# Altium project Apalis Evaluation Board.PrjPCB (part 3 of 5)

## Sheet Power_Switch.SchDoc: Apalis Evaluation Board 1.1
size A3; Organization: Toradex AG; Address1: Altsagenstrasse 5; Address2: Horw; Address3: 6048; Address4: Switzerland; DocumentNumber: 4; Revision: V1.1; SheetNumber: 4; SheetTotal: 32; PageSetup: Record=PageOptions|CenterHorizontal=True|CenterVertical=True|PrintScale=0.73|XCorrection=1.00|YCorrection=1.00|PrintKind=0|BorderSize=5000000|LeftOffset=0|BottomOffset=0|Orientation=2|PaperLength=1000|PaperWidth=1000|Scale=100|PaperSource=7|PrintQuality=-4|MediaType=1|DitherType=10|PaperKind=A4|PrintScaleMode=1
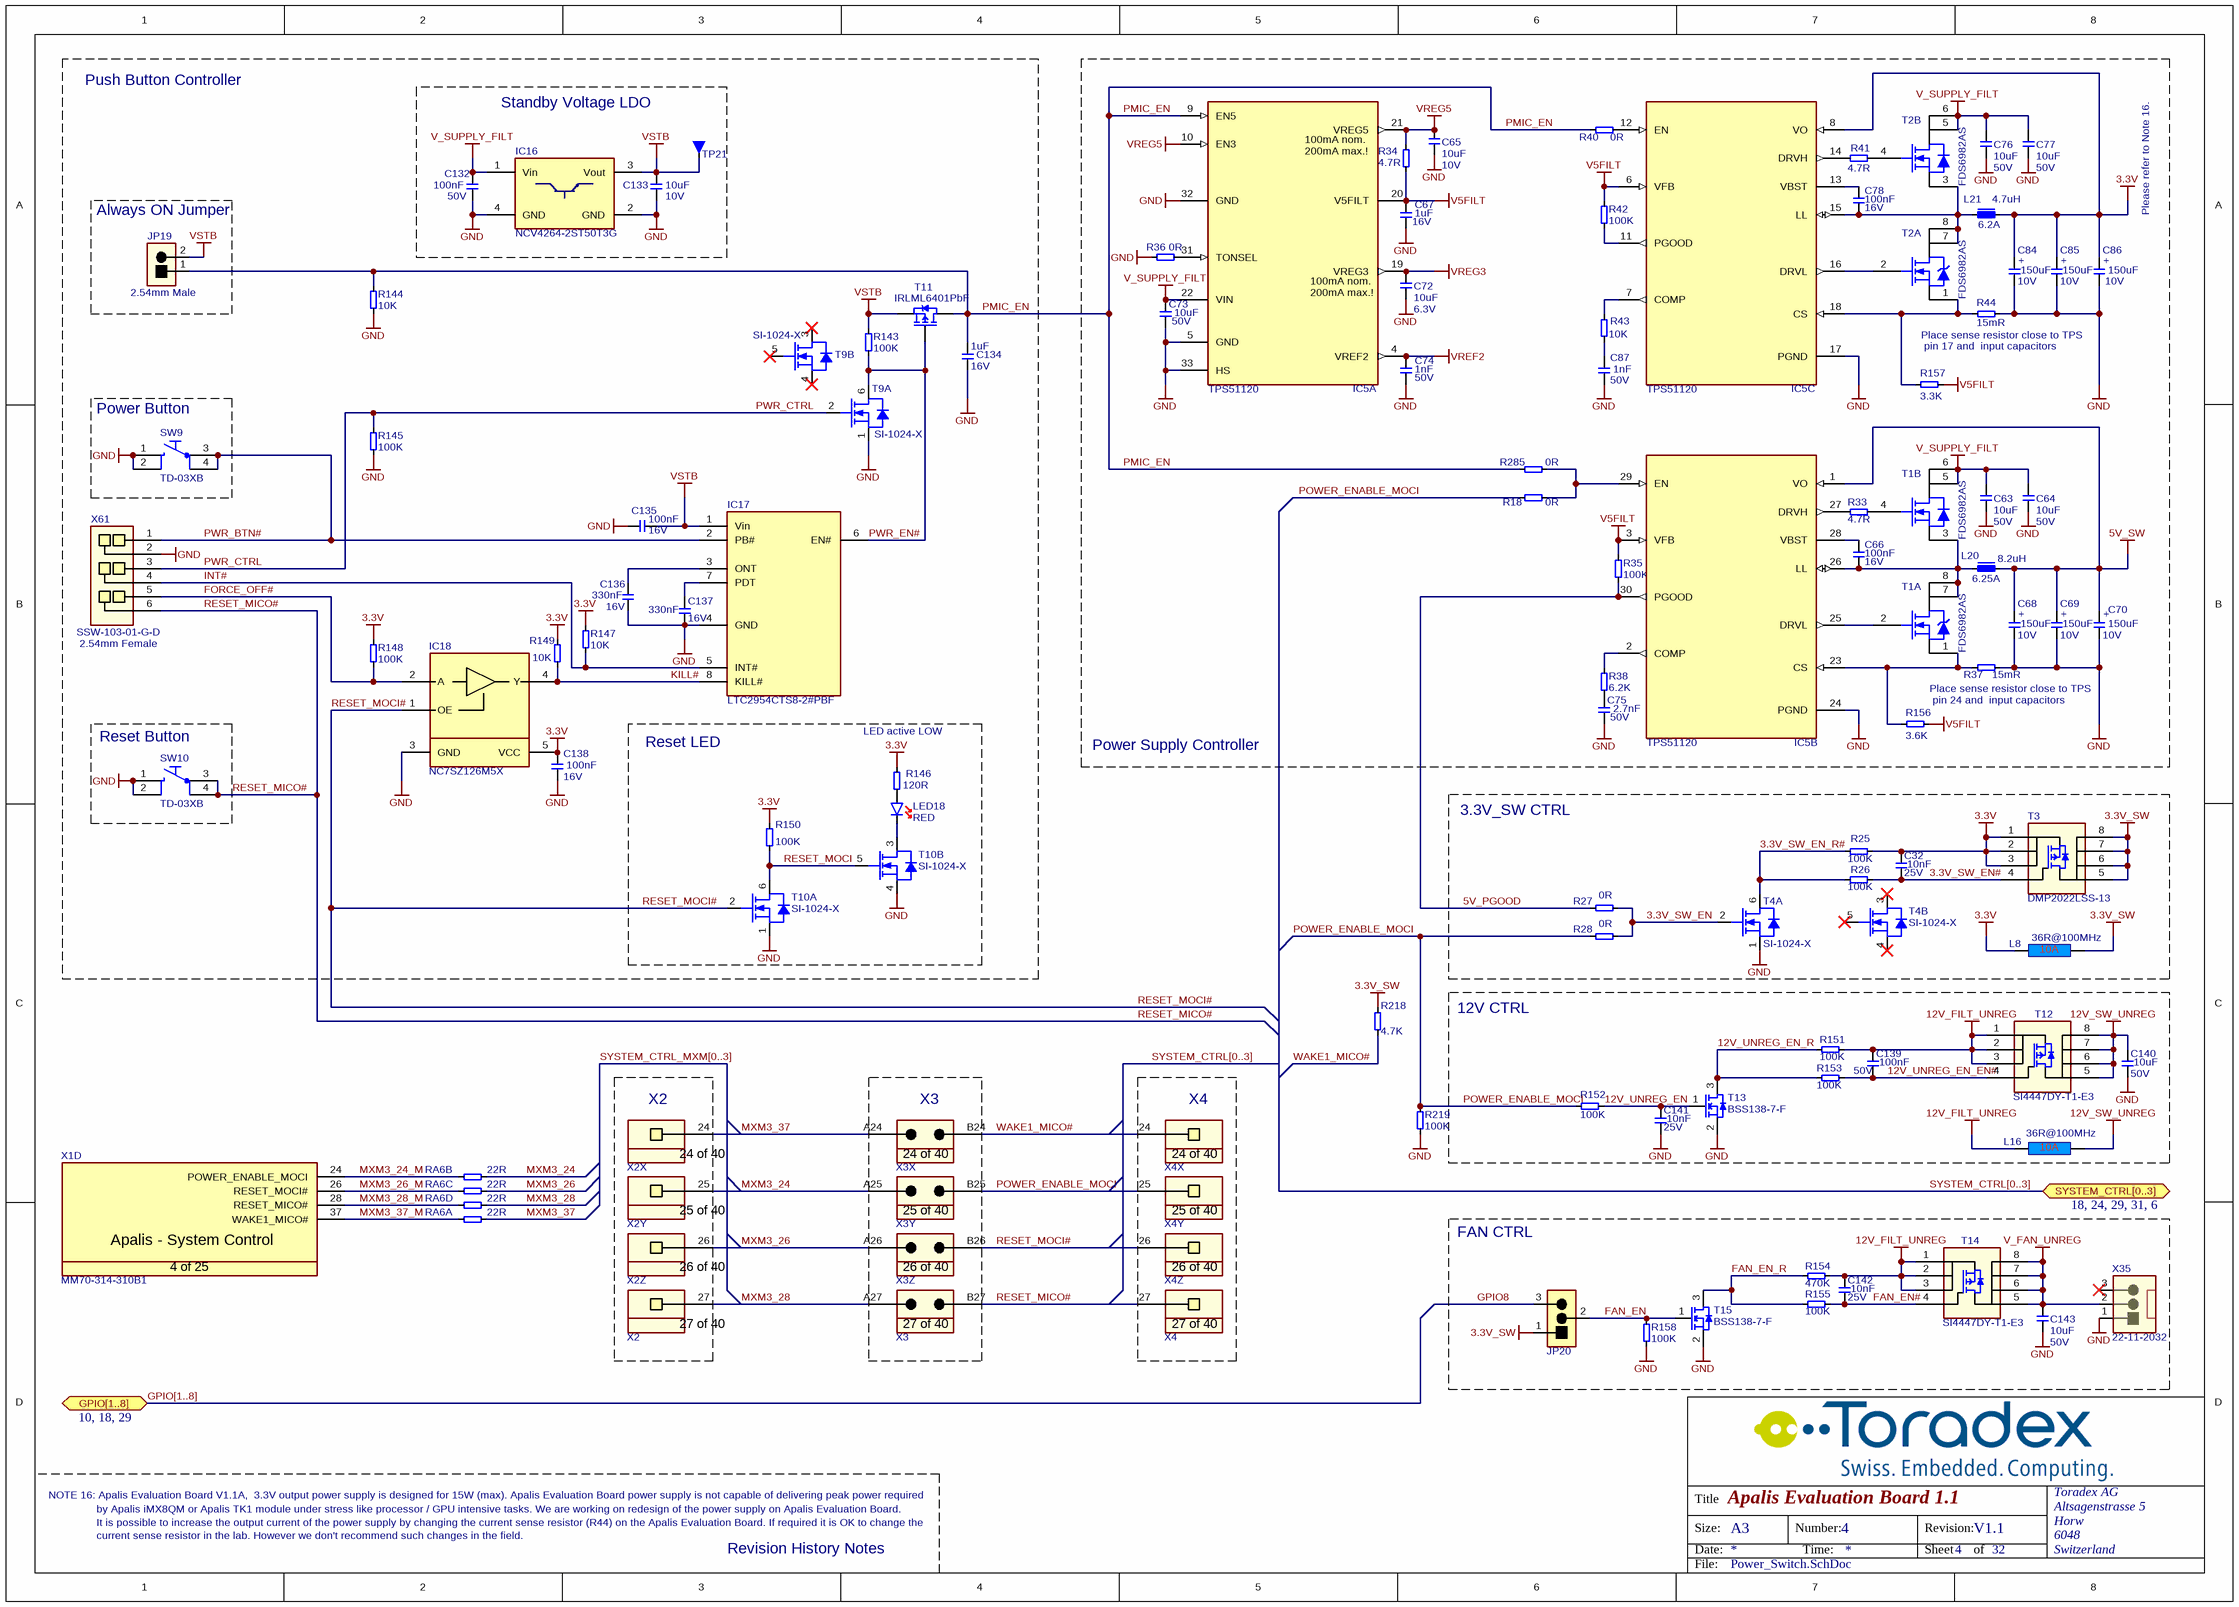
[diagram p14: Power_Switch.SchDoc]

### Parts
C32  Rating: 25V  [T_CAPC0603X33N]  (hidden comment: 10nF)
C63  Rating: 50V  [CAPC3225X160N]  (hidden comment: 10uF)
C64  Rating: 50V  [CAPC3225X160N]  (hidden comment: 10uF)
C65  Rating: 10V  [T_CAPC0805X125N]  (hidden comment: 10uF)
C66  Rating: 16V  [T_CAPC0603X33N]  (hidden comment: 100nF)
C67  Rating: 16V  [T_CAPC0603X33N]  (hidden comment: 1uF)
C68  Rating: 10V  [CAPMP7343X310N]  (hidden comment: 150uF)
C69  Rating: 10V  [CAPMP7343X310N]  (hidden comment: 150uF)
C70  Rating: 10V  [CAPMP7343X310N]  (hidden comment: 150uF)
C72  Rating: 6.3V  [T_CAPC0603X33N]  (hidden comment: 10uF)
C73  Rating: 50V  [CAPC3225X160N]  (hidden comment: 10uF)
C74  Rating: 50V  [T_CAPC0603X33N]  (hidden comment: 1nF)
C75  Rating: 50V  [CAPC1005X60N]  (hidden comment: 2.7nF)
C76  Rating: 50V  [CAPC3225X160N]  (hidden comment: 10uF)
C77  Rating: 50V  [CAPC3225X160N]  (hidden comment: 10uF)
C78  Rating: 16V  [T_CAPC0603X33N]  (hidden comment: 100nF)
C84  Rating: 10V  [CAPMP7343X310N]  (hidden comment: 150uF)
C85  Rating: 10V  [CAPMP7343X310N]  (hidden comment: 150uF)
C86  Rating: 10V  [CAPMP7343X310N]  (hidden comment: 150uF)
C87  Rating: 50V  [T_CAPC0603X33N]  (hidden comment: 1nF)
C132  Rating: 50V  [T_CAPC0603X33N]  (hidden comment: 100nF)
C133  Rating: 10V  [T_CAPC0805X125N]  (hidden comment: 10uF)
C134  Rating: 16V  [T_CAPC0603X33N]  (hidden comment: 1uF)
C135  Rating: 16V  [T_CAPC0603X33N]  (hidden comment: 100nF)
C136  Rating: 16V  [T_CAPC0805X125N]  (hidden comment: 330nF)
C137  Rating: 16V  [T_CAPC0805X125N]  (hidden comment: 330nF)
C138  Rating: 16V  [T_CAPC0603X33N]  (hidden comment: 100nF)
C139  Rating: 50V  [T_CAPC0603X33N]  (hidden comment: 100nF)
C140  Rating: 50V  [CAPC3225X160N]  (hidden comment: 10uF)
C141  Rating: 25V  [T_CAPC0603X33N]  (hidden comment: 10nF)
C142  Rating: 25V  [T_CAPC0603X33N]  (hidden comment: 10nF)
C143  Rating: 50V  [CAPC3225X160N]  (hidden comment: 10uF)
IC5  TPS51120  [QFN50P500X500X100-33N]  (parts A,B,C of 3)
IC16  NCV4264-2ST50T3G  [T_ON_NCV4264-2ST50T3G]
IC17  LTC2954CTS8-2#PBF  [T_LINEAR_LTC2954CTS8-2#PBF]
IC18  NC7SZ126M5X  [SOT95P279X142-5N]
JP19  TSW-101-07-G-D  [T_Samtec_TSW-101-07-G-D]  (value not drawn)
JP20  826936-3  [T_TYCO_826936-3]  (value not drawn)
L8  36R@100MHz  [T_Laird_35F0121-0SR-10]
L16  36R@100MHz  [T_Laird_35F0121-0SR-10]
L20  Rating: 6.25A  [T_INDM120120X80N]  (hidden comment: 8.2uH)
L21  Rating: 6.2A  [T_INDM102102X45N]  (hidden comment: 4.7uH)
LED18  Color: RED  [T_Osram_T670_RED]  (hidden comment: LS T670-K1L2-1)
R18  0R  [T_RESC0603X30N]
R25  100K  [T_RESC0603X30N]
R26  100K  [T_RESC0603X30N]
R27  0R  [T_RESC0603X30N]
R28  0R  [T_RESC0603X30N]
R33  4.7R  [RESC1005X40N]
R34  4.7R  [RESC1005X40N]
R35  100K  [T_RESC0603X30N]
R36  0R  [T_RESC0603X30N]
R37  15mR  [RESC3316X76N]
R38  6.2K  [RESC1005X40N]
R40  0R  [T_RESC0603X30N]
R41  4.7R  [RESC1005X40N]
R42  100K  [T_RESC0603X30N]
R43  10K  [RESC1005X40N]
R44  15mR  [RESC3316X76N]
R143  100K  [T_RESC0603X30N]
R144  10K  [T_RESC0603X30N]
R145  100K  [T_RESC0603X30N]
R146  120R  [T_RESC0603X30N]
R147  10K  [T_RESC0603X30N]
R148  100K  [T_RESC0603X30N]
R149  10K  [T_RESC0603X30N]
R150  100K  [T_RESC0603X30N]
R151  100K  [T_RESC0603X30N]
R152  100K  [T_RESC0603X30N]
R153  100K  [T_RESC0603X30N]
R154  470K  [T_RESC0603X30N]
R155  100K  [T_RESC0603X30N]
R156  3.6K  [T_RESC0603X30N]
R157  3.3K  [T_RESC0603X30N]
R158  100K  [T_RESC0603X30N]
R218  4.7K  [t_RESC0603X30N]
R219  100K  [T_RESC0603X30N]
R285  0R  [T_RESC0603X30N]
RA6  22R  [T_Resistor_Array_X4]  (parts A,B,C,D of 4)
SW9  TD-03XB  [T_WMF_TD-03XB]
SW10  TD-03XB  [T_WMF_TD-03XB]
T1  FDS6982AS  [SOIC127P600X173-8N]  (parts A,B of 2)
T2  FDS6982AS  [SOIC127P600X173-8N]  (parts A,B of 2)
T3  DMP2022LSS-13  [SOIC127P600X173-8N]
T4  Manufacturer Part No.: SI-1024-X  [SOTFL50P160X60-6N]  (hidden comment: T-Vishay-SI-1024X-N)  (parts A,B of 2)
T9  Manufacturer Part No.: SI-1024-X  [SOTFL50P160X60-6N]  (hidden comment: T-Vishay-SI-1024X-N)  (parts A,B of 2)
T10  Manufacturer Part No.: SI-1024-X  [SOTFL50P160X60-6N]  (hidden comment: T-Vishay-SI-1024X-N)  (parts A,B of 2)
T11  IRLML6401PbF  [SOT95P237X112-3N]
T12  SI4447DY-T1-E3  [SOIC127P600X173-8N]
T13  BSS138-7-F  [SOT95P237X112-3N]
T14  SI4447DY-T1-E3  [SOIC127P600X173-8N]
T15  BSS138-7-F  [SOT95P237X112-3N]
TP21  Testpin  [T_TP-THT]  (value not drawn)
X1  Manufacturer Part No.: MM70-314-310B1  [T_JAE_MM70-314-310B1]  (hidden comment: CON-JAE-MM70-314-310B1-314-0.5mm)  (part D of 25)
X2  SSW-110-01-G-S  [T_Samtec_SSW-110-01-G-S]  (value not drawn)  (parts X,Y,Z,27 of 40)
X3  TSW-110-07-G-D  [T_Samtec_TSW-110-07-G-D]  (value not drawn)  (parts X,Y,Z,27 of 40)
X4  SSW-110-01-G-S  [T_Samtec_SSW-110-01-G-S]  (value not drawn)  (parts X,Y,Z,27 of 40)
X35  22-11-2032  [T_MOLEX_22-11-2032]
X61  Manufacturer Part No.: SSW-103-01-G-D  [T_Samtec_SSW-103-01-G-D]  (hidden comment: TSW-103-01-G-D)

### Blocks framed on the sheet
Push Button Controller: C134-C138 IC17 IC18 R143-R145 R147-R149 T9 T11 X61
Power Supply Controller: C63-C70 C72-C78 C84-C87 IC5 L20 L21 R18 R33-R38 R40-R44 R156 R157 R285 T1 T2
Standby Voltage LDO: C132 C133 IC16 TP21
Always ON Jumper: JP19
Power Button: SW9
Reset Button: SW10
Reset LED: LED18 R146 R150 T10
3.3V_SW CTRL: C32 L8 R25-R28 T3 T4
12V CTRL: C139-C141 L16 R151-R153 T12 T13
X2: X2
X3: X3
X4: X4
FAN CTRL: C142 C143 JP20 R154 R155 R158 T14 T15 X35

### Ports
GPIO[1..8] (bidir, see 10, 18, 29), SYSTEM_CTRL[0..3] (bidir, see 18, 24, 29, 31, 6)

### Nets
3.3V: C32.2 C84.1 C85.1 C86.1 C138.1 IC5.8(VO) IC18.5(VCC) L8.1 L21.2 R25.1 R146.2 R147.1 R148.2 R149.1 R150.2 T3.1(S) T3.2(S) T3.3(S)
3.3V_SW: JP20.1 L8.2 R218.1 T3.5(D) T3.6(D) T3.7(D) T3.8(D)
5V_SW: C68.1 C69.1 C70.1 IC5.1(VO) L20.2
12V_FILT_UNREG: C139.2 C142.2 L16.1 R151.2 R154.2 T12.1(S) T12.2(S) T12.3(S) T14.1(S) T14.2(S) T14.3(S)
12V_SW_UNREG: C140.2 L16.2 T12.5(D) T12.6(D) T12.7(D) T12.8(D)
GND: C63.1 C64.1 C65.1 C67.1 C68.2 C69.2 C70.2 C72.1 C73.1 C74.1 C75.1 C76.1 C77.1 C84.2 C85.2 C86.2 C87.1 C132.1 C133.1 C134.1 C135.1 C136.1 C137.1 C138.2 C140.1 C141.1 C143.1 IC5.5(GND) IC5.17(PGND) IC5.24(PGND) IC5.32(GND) IC5.33(HS) IC16.2(GND) IC16.4(GND) IC17.4(GND) IC18.3(GND) R36.1 R37.2 R44.2 R144.1 R145.1 R158.2 R219.1 SW9.1 SW9.2 SW10.1 SW10.2 T4.1(S) T9.1(S) T10.1(S) T10.4(S) T13.2 T15.2 X35.1 X61.2
V5FILT: C67.2 IC5.3(VFB) IC5.6(VFB) IC5.20(V5FILT) R34.1 R35.2 R42.2 R156.2 R157.2
V_FAN_UNREG: C143.2 T14.5(D) T14.6(D) T14.7(D) T14.8(D) X35.2
V_SUPPLY_FILT: C63.2 C64.2 C73.2 C76.2 C77.2 C132.2 IC5.22(VIN) IC16.1(Vin) T1.5(D) T1.6(D) T2.5(D) T2.6(D)
VREF2: C74.2 IC5.4(VREF2)
VREG3: C72.2 IC5.19(VREG3)
VREG5: C65.2 IC5.10(EN3) IC5.21(VREG5) R34.2
VSTB: C133.2 C135.2 IC16.3(Vout) IC17.1(Vin) JP19.2 R143.2 T11.2 TP21.1
3.3V_SW_EN: R27.1 R28.2 T4.2(G)
3.3V_SW_EN#: C32.1 R26.1 T3.4(G)
3.3V_SW_EN_R#: R25.2 R26.2 T4.6(D)
5V_PGOOD: IC5.30(PGOOD) R27.2 R35.1
12V_UNREG_EN: C141.2 R152.2 T13.1
12V_UNREG_EN_EN#: C139.1 R153.2 T12.4(G)
12V_UNREG_EN_R: R151.1 R153.1 T13.3
FAN_EN: JP20.2 R158.1 T15.1
FAN_EN#: C142.1 R155.2 T14.4(G)
FAN_EN_R: R154.1 R155.1 T15.3
FORCE_OFF#: IC18.2(A) R148.1 X61.5
GPIO8: JP20.3
INT#: IC17.5(INT#) R147.2 X61.4
KILL#: IC17.8(KILL#) IC18.4(Y) R149.2
MXM3_24: RA6.6 X2.25 X3.A25
MXM3_24_M: RA6.2 X1.24(POWER_ENABLE_MOCI)
MXM3_26: RA6.7 X2.26 X3.A26
MXM3_26_M: RA6.3 X1.26(RESET_MOCI#)
MXM3_28: RA6.8 X2.27 X3.A27
MXM3_28_M: RA6.4 X1.28(RESET_MICO#)
MXM3_37: RA6.5 X2.24 X3.A24
MXM3_37_M: RA6.1 X1.37(WAKE1_MICO#)
PMIC_EN: C134.2 IC5.9(EN5) JP19.1 R40.1 R144.2 R285.1 T11.3
POWER_ENABLE_MOCI: R18.1 R28.1 R152.1 R219.2 X3.B25 X4.25
PWR_BTN#: IC17.2(PB#) SW9.3 SW9.4 X61.1
PWR_CTRL: R145.2 T9.2(G) X61.3
PWR_EN#: IC17.6(EN#) R143.1 T9.6(D) T11.1
RESET_MICO#: SW10.3 SW10.4 X3.B27 X4.27 X61.6
RESET_MOCI: R150.1 T10.5(G) T10.6(D)
RESET_MOCI#: IC18.1(OE) T10.2(G) X3.B26 X4.26
WAKE1_MICO#: R218.2 X3.B24 X4.24
NetC66_1: C66.1 IC5.26(LL) L20.1 T1.3(S) T1.7(D) T1.8(D)
NetC66_2: C66.2 IC5.28(VBST)
NetC75_2: C75.2 R38.1
NetC78_1: C78.1 IC5.15(LL) L21.1 T2.3(S) T2.7(D) T2.8(D)
NetC78_2: C78.2 IC5.13(VBST)
NetC87_2: C87.2 R43.1
NetC136_2: C136.2 IC17.3(ONT)
NetC137_2: C137.2 IC17.7(PDT)
NetIC5_2: IC5.2(COMP) R38.2
NetIC5_7: IC5.7(COMP) R43.2
NetIC5_11: IC5.11(PGOOD) R42.1
NetIC5_12: IC5.12(EN) R40.2
NetIC5_14: IC5.14(DRVH) R41.1
NetIC5_16: IC5.16(DRVL) T2.2(G)
NetIC5_18: IC5.18(CS) R44.1 R157.1 T2.1(S)
NetIC5_23: IC5.23(CS) R37.1 R156.1 T1.1(S)
NetIC5_25: IC5.25(DRVL) T1.2(G)
NetIC5_27: IC5.27(DRVH) R33.1
NetIC5_29: IC5.29(EN) R18.2 R285.2
NetIC5_31: IC5.31(TONSEL) R36.2
NetLED18_A: LED18.A R146.1
NetLED18_K: LED18.K T10.3(D)
NetR33_2: R33.2 T1.4(G)
NetR41_2: R41.2 T2.4(G)

Not connected (* = marked no-connect by the designer): T4 3(D)* 4(S)* 5(G)*; T9 3(D)* 4(S)* 5(G)*; X35 3*

### Buses and harness runs
bus GPIO[1..8] = port GPIO[1..8]
bus SYSTEM_CTRL[0..3] = port SYSTEM_CTRL[0..3]
bus SYSTEM_CTRL_MXM[0..3]

### Notes on the sheet
- Please refer to Note 16.
- (near JP19) 2.54mm Male
- (near R44) Place sense resistor close to TPS
- pin 17 and  input capacitors
- (near X61) 2.54mm Female
- Place sense resistor close to TPS
- LED active LOW
- pin 24 and  input capacitors
- NOTE 16: Apalis Evaluation Board V1.1A,  3.3V output power supply is designed for 15W (max). Apalis Evaluation Board power supply is not capable of delivering peak power required
- by Apalis iMX8QM or Apalis TK1 module under stress like processor / GPU intensive tasks. We are working on redesign of the power supply on Apalis Evaluation Board.
- It is possible to increase the output current of the power supply by changing the current sense resistor (R44) on the Apalis Evaluation Board. If required it is OK to change the
- current sense resistor in the lab. However we don't recommend such changes in the field.
- Revision History Notes
- Title
- Size:
- Date:
- A3
- Number:
- Time:
- Revision:
- Sheet
- of
- File:
- (in symbol C-TA-150uF-10V-10%-7343) +
- (in symbol CON-JAE-MM70-314-310B1-314-0.5mm, part D) Apalis - System Control; 4 of 25
- (in symbol CON-Samtec-SSW-110-01-G-S, part X) 24 of 40
- (in symbol CON-Samtec-SSW-110-01-G-S, part Y) 25 of 40
- (in symbol CON-Samtec-SSW-110-01-G-S, part Z) 26 of 40
- (in symbol CON-Samtec-SSW-110-01-G-S, part 27) 27 of 40
- (in symbol CON-Samtec-TSW-110-07-G-D, part X) 24 of 40
- (in symbol CON-Samtec-TSW-110-07-G-D, part Y) 25 of 40
- (in symbol CON-Samtec-TSW-110-07-G-D, part Z) 26 of 40
- (in symbol CON-Samtec-TSW-110-07-G-D, part 27) 27 of 40
- (in symbol IC-TI-TPS51120, part A) 100mA nom.; 200mA max.!

### Library data of the parts
C32 C141 C142 = C-X7R-10nF-25V-10%-0603: Capacitor Ceramic X7R 10nF 25V 10% 0603; Tolerance: 10%; Type: X7R; Value: 10nF
C63 C64 C73 C76 C77 C140 C143 = C-X5R-10uF-50V-20%-1210: Capacitor Ceramic X5R 10uF 50V 20% 1210; Tolerance: 20%; Type: X5R; Value: 10uF
C65 C133 = C-X5R-10uF-10V-20%-0805: Capacitor Ceramic X5R 10uF 10V 20% 0805; Tolerance: 20%; Type: X5R; Value: 10uF
C66 C78 C135 C138 = C-X7R-100nF-16V-10%-0603: Capacitor Ceramic X7R 100nF 16V 10% 0603; Tolerance: 10%; Type: X7R; Value: 100nF
C67 C134 = C-X5R-1uF-16V-20%-0603: Capacitor Ceramic X5R 1uF 16V 20% 0603; Tolerance: 20%; Type: X5R; Value: 1uF
C68-C70 C84-C86 = C-TA-150uF-10V-10%-7343: Capacitor TA 150uF 10V 10% 7343; Tolerance: 10%; Type: TA; Value: 150uF
C72 = C-X5R-10uF-6.3V-20%-0603: Capacitor Ceramic X5R 10uF 6.3V 20% 0603; Tolerance: 20%; Type: X5R; Value: 10uF
C74 C87 = C-X7R-1nF-50V-10%-0603: Capacitor Ceramic X7R 1nF 50V 10% 0603; Tolerance: 10%; Type: X7R; Value: 1nF
C75 = C-X7R-2.7nF-50V-10%-0402: Capacitor Ceramic X7R 2.7nF 50V 10% 0402; Tolerance: 10%; Type: X7R; Value: 2.7nF
C132 C139 = C-X7R-100nF-50V-20%-0603: Capacitor Ceramic X7R 100nF 50V 20% 0603; Tolerance: 20%; Type: X7R; Value: 100nF
C136 C137 = C-X7R-330nF-16V-10%-0805: Capacitor Ceramic X7R 330nF 16V 10% 0805; Tolerance: 10%; Type: X7R; Value: 330nF
IC5 = IC-TI-TPS51120: Power Supply Controller; Manufacturer Name: Texas Instruments; Manufacturer Part No.: TPS51120
IC16 = IC-ON-NCV4264-2ST50T3G: NCV4264-2ST50T3G LDO Regulator; Manufacturer Name: ON Semiconductor; Manufacturer Part No.: NCV4264-2ST50T3G
IC17 = IC-LIN-LTC2954CTS8-2#PBF: Push Button On/Off Controller; Manufacturer Name: Linear; Manufacturer Part No.: LTC2954CTS8-2#PBF
IC18 = IC-FAR-NC7SZ126M5X: NC7SZ126M5X  Buffer Three-State Output; Manufacturer Name: Fairchild Semiconductor; Manufacturer Part No.: NC7SZ126M5X
JP19 = CON-Samtec-TSW-101-07-G-D: Header male, 1x2 Pins, 2.54 mm pitch; Manufacturer Name: Samtec; Pitch: 2.54 mm; No. of ways: 1x2; Manufacturer Part no.: TSW-101-07-G-D
JP20 = CON-Tyco-826936-3-1X3-2.54mm-JP_1: Jumper, 3-Pin; Manufacturer Name: Tyco; No. of ways: 1X3; Pitch: 2.54mm; Manufacturer Part No.: 826936-3
L8 L16 = L-Laird-35F0121-0SR-10-10A-25%: Power Supply FB 10A; Tolerance: 25%; Rating: 10A; Value: 36R@100MHz
L20 = L-Wurth-744771008-8.2uH-6.25A-20%: Inductance 8.2uH 6.25A 20%; Manufacturer Name: Wurth; Tolerance: 20%; Manufacturer Part No.: 744771008; Value: 8.2uH
L21 = L-Wurth-7447797470-4.7uH-6.2A-20%: Inductance 4.7uH 6.2A 20%; Manufacturer Name: Wurth; Tolerance: 20%; Manufacturer Part No.: 7447797470; Value: 4.7uH
LED18 = LED-Osram-LS T670-K1L2-1: LED red, Osram LS T670-K1L2-1; Manufacturer Name: Osram; Manufacturer Part No.: LS T670-K1L2-1
R18 R27 R28 R36 R40 R285 = R-0R-63mW-1%-0603: Resistor 0 ohm 63mW 1% 0603; Rating: 63mW; Tolerance: 1%; Value: 0R
R25 R26 R35 R42 R143 R145 R148 R150-R153 R155 R158 R219 = R-100KR-63mW-5%-0603: as R109 on sheet LEDs_Switches; Rating: 63mW; Tolerance: 5%
R33 R34 R41 = R-4.7R-63mW-5%-0402: Resistor 4.7 ohm 63mW 5% 0402; Rating: 63mW; Tolerance: 5%; Value: 4.7R
R37 R44 = R-15mR-250mW-1%-1206: Resistor 15 mohm 250mW 1% 1206; Rating: 250mW; Tolerance: 1%; Value: 15mR
R38 = R-6.2KR-63mW-1%-0402: Resistor 6.2 Kohm 63mW 1% 0402; Value: 6.2KR; Rating: 63mW; Tolerance: 1%
R43 = R-10KR-63mW-1%-0402: Resistor 10 Kohm 63mW 1% 0402; Value: 10KR; Rating: 63mW; Tolerance: 1%
R144 R147 R149 = R-10KR-63mW-5%-0603: Resistor 10 Kohm 63mW 5% 0603; Value: 10KR; Rating: 63mW; Tolerance: 5%
R146 = R-120R-63mW-5%-0603: Resistor 120 ohm 63mW 5% 0603; Rating: 63mW; Tolerance: 5%; Value: 120R
R154 = R-470KR-63mW-5%-0603: Resistor 470 Kohm 63mW 5% 0603; Value: 470KR; Rating: 63mW; Tolerance: 5%
R156 = R-3.6KR-63mW-1%-0603: Resistor 3.6 Kohm 63mW 1% 0603; Value: 3.6KR; Rating: 63mW; Tolerance: 1%
R157 = R-3.3KR-63mW-1%-0603: Resistor 3.3 Kohm 63mW 1% 0603; Value: 3.3KR; Rating: 63mW; Tolerance: 1%
R218 = R-4.7kR-63mW-5%-0603: Resistor 4.7 Kohm 63mW 5% 0603; Value: 4.7KR; Rating: 63mW; Tolerance: 5%
RA6 = RA-22R-63mW-5%-1206-div: Resistor Array 22 R 63mW 5% 1206; Tolerance: 5%; Power Dissipation: 63mW; Value: 22R
SW9 SW10 = SW-WMF-TD-03XB: Push Button; Manufacturer Name: WMF; Rating: 50mA; Manufacturer Part No.: TD-03XB
T1 T2 = T-Fairchild-FDS6982AS-N: N-Channel PowerTrench SyncFET; Manufacturer Name: Fairchild; Manufacturer Part No.: FDS6982AS
T3 = T-Diodes-DMP2022LSS-13-8-SOIC: p-channel MOSFET, DMP2022LSS-13; Manufacturer Name: DIODES; Manufacturer Part No.: DMP2022LSS-13
T4 T9 T10 = T-Vishay-SI-1024X-N: as T5 on sheet LEDs_Switches
T11 = T-IR-IRLML6401PbF-SOT-23: p-channel MOSFET, IRLML6401PbF; Manufacturer Name: International Rectifier; Manufacturer Part No.: IRLML6401PbF
T12 T14 = T-Vishay-SI4447DY-T1-E3: p-channel MOSFET, SI4447DY-T1-E3; Manufacturer Name: Vishay; Manufacturer Part No.: SI4447DY-T1-E3
T13 T15 = T-Diodes-BSS138-7-F: N-channel MOSFET, BSS138-7-F; Manufacturer Name: Diodes; Manufacturer Part No.: BSS138-7-F
TP21 = Testpin: Testpin TH
X1 = CON-JAE-MM70-314-310B1-314-0.5mm: as X1 on sheet PCI_Express_Switch
X2 X4 = CON-Samtec-SSW-110-01-G-S: as X2 on sheet Power_Supply; Pitch: 2.54mm; No. of ways: 1x40; Manufacturer Part No.: SSW-110-01-G-S
X3 = CON-Samtec-TSW-110-07-G-D: as X3 on sheet Power_Supply; Pitch: 2.54mm; No. of ways: 2x40; Manufacturer Part No.: TSW-110-07-G-D
X35 = CON-Molex-22-11-2032: Header with Friction Lock; Manufacturer Name: Molex; No. of ways: 3; Manufacturer Part No.: 22-11-2032
X61 = CON-Samtec-SSW-103-01-G-D: Receptacle Female Socket, 2x3 Pins, 2.54mm pitch; Manufacturer Name: Samtec; No. of ways: 2x3; Pitch: 2.54mm

## Sheet RGB_Displays.SchDoc: Apalis Evaluation Board 1.1
size A3; Organization: Toradex AG; Address1: Altsagenstrasse 5; Address2: Horw; Address3: 6048; Address4: Switzerland; DocumentNumber: 18; Revision: V1.1; SheetNumber: 18; SheetTotal: 32; PageSetup: Record=PageOptions|CenterHorizontal=True|CenterVertical=True|PrintScale=0.73|XCorrection=1.00|YCorrection=1.00|PrintKind=0|BorderSize=5000000|LeftOffset=0|BottomOffset=0|Orientation=2|PaperLength=1000|PaperWidth=1000|Scale=100|PaperSource=7|PrintQuality=-4|MediaType=1|DitherType=10|PaperKind=A4|PrintScaleMode=1
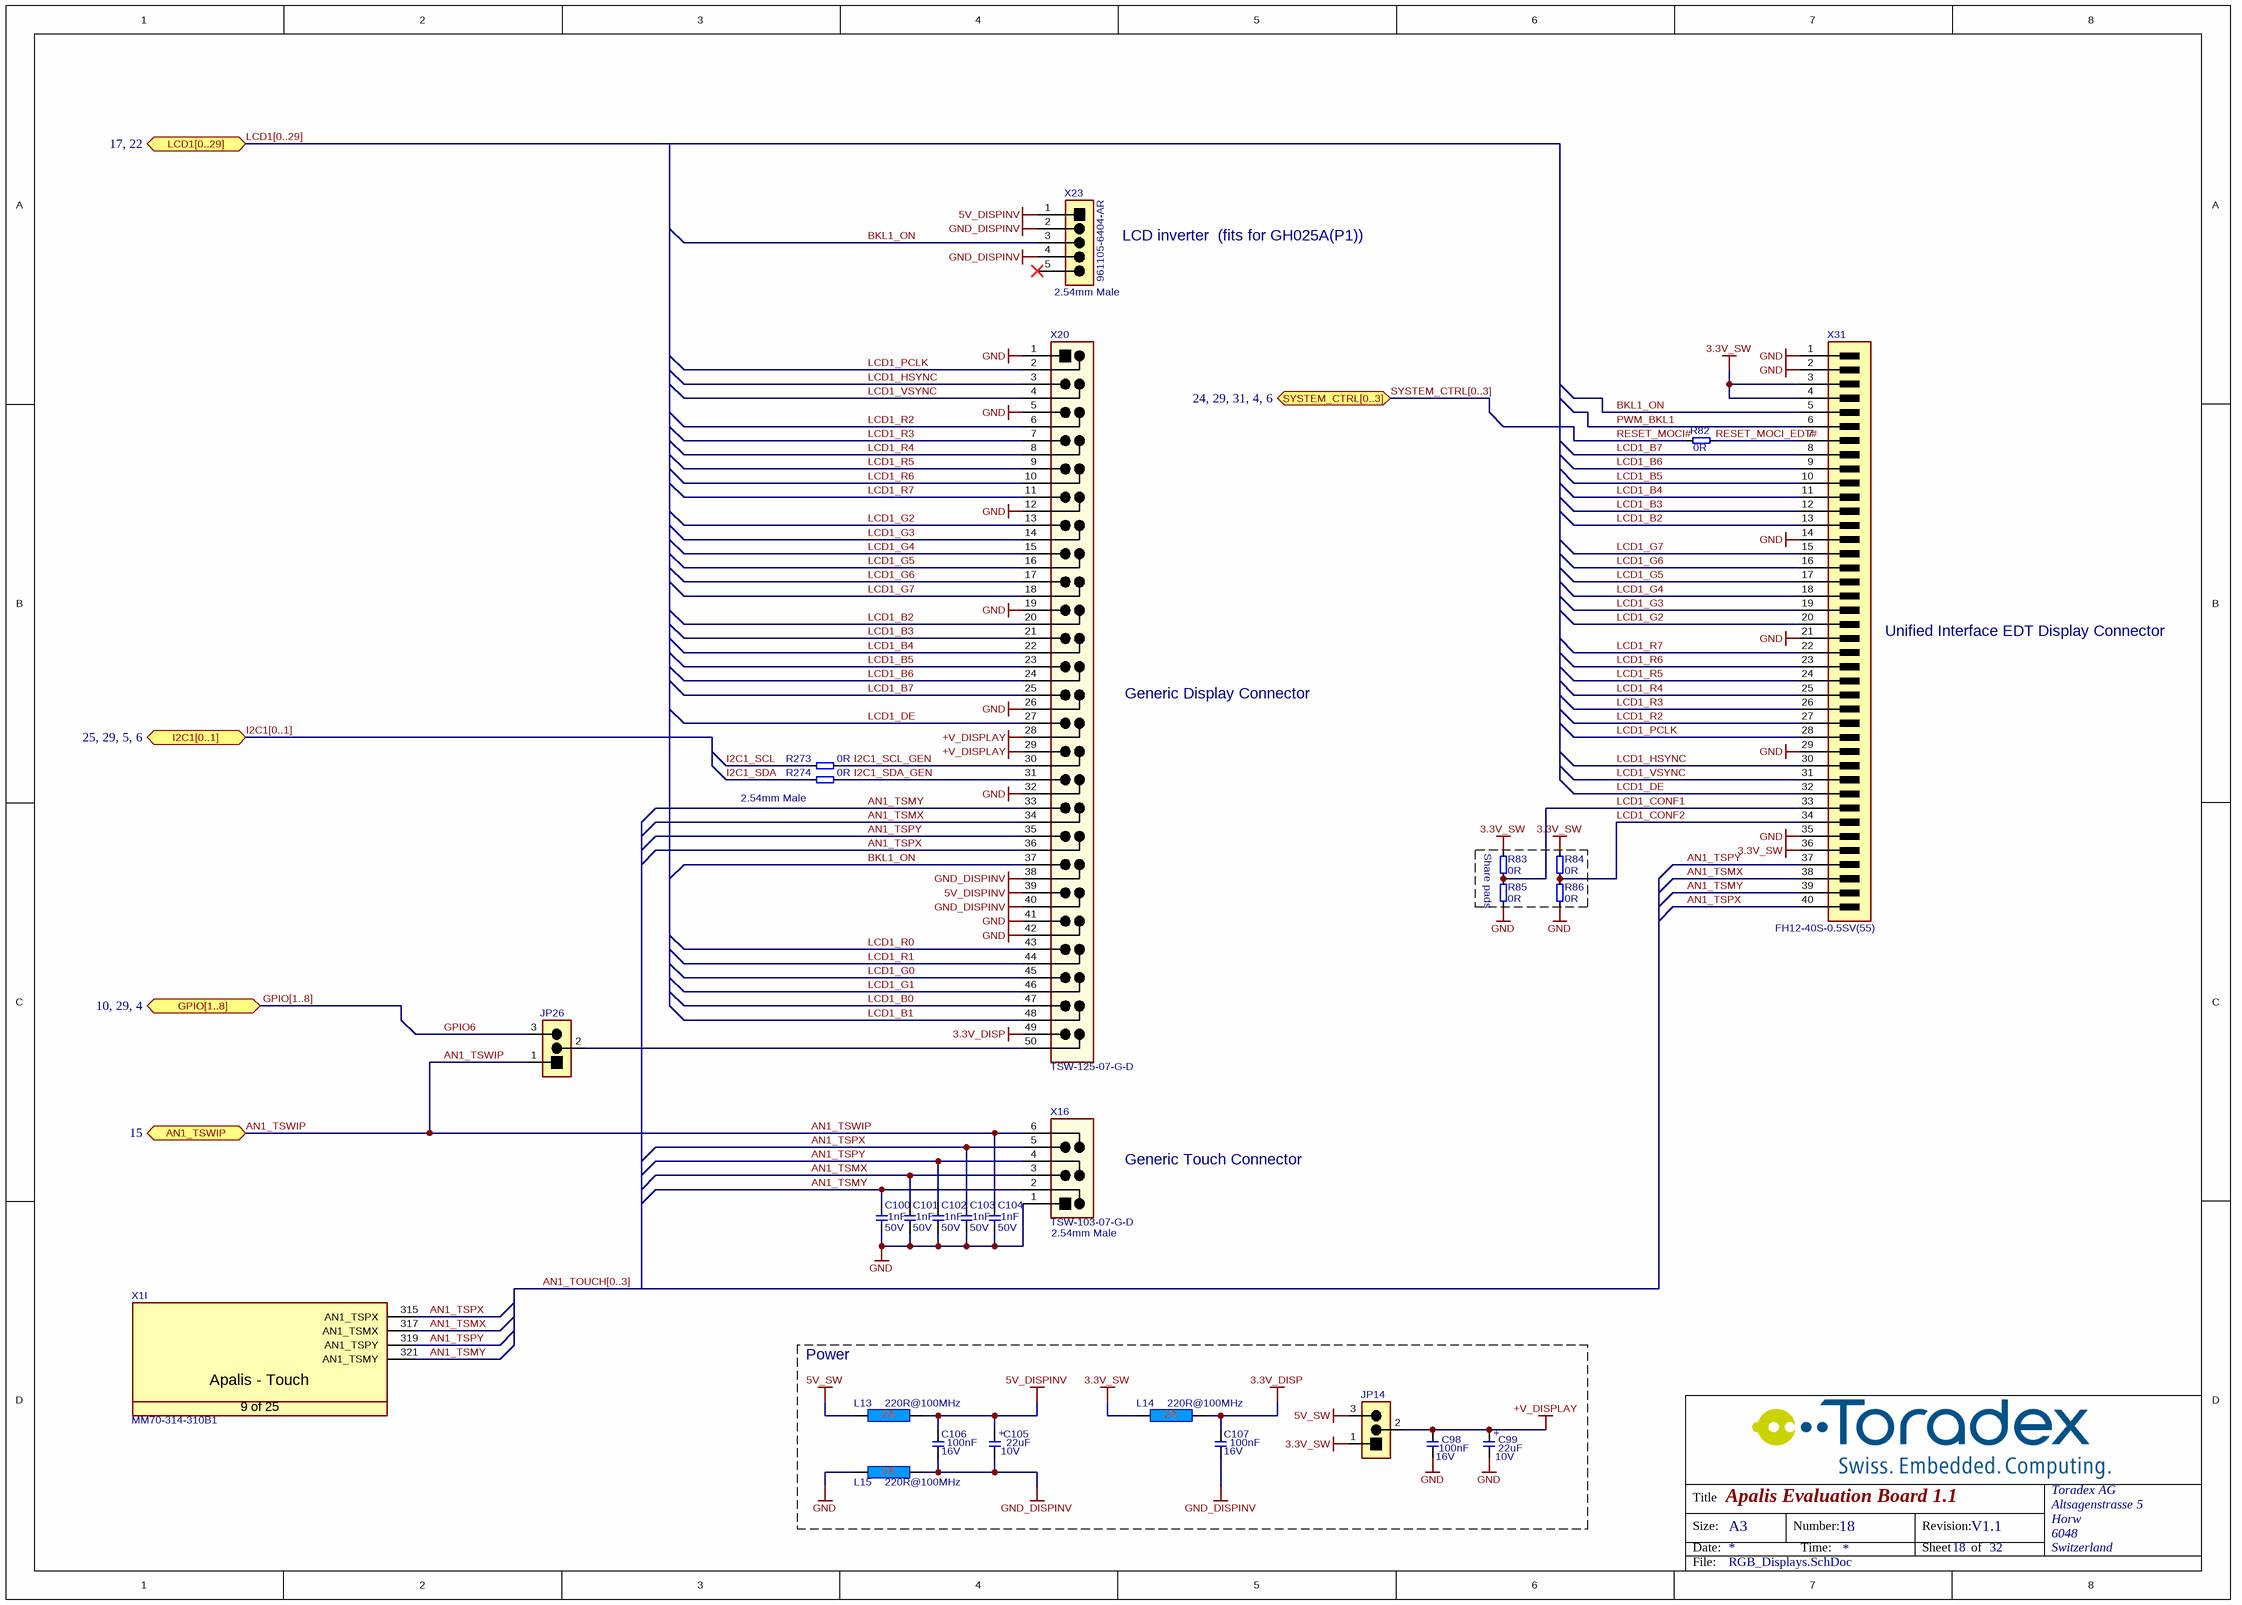
[diagram p15: RGB_Displays.SchDoc]

### Parts
C98  Rating: 16V  [T_CAPC0603X33N]  (hidden comment: 100nF)
C99  Rating: 10V  [CAPMP3528X210N]  (hidden comment: 22uF)
C100  Rating: 50V  [T_CAPC0603X33N]  (hidden comment: 1nF)
C101  Rating: 50V  [T_CAPC0603X33N]  (hidden comment: 1nF)
C102  Rating: 50V  [T_CAPC0603X33N]  (hidden comment: 1nF)
C103  Rating: 50V  [T_CAPC0603X33N]  (hidden comment: 1nF)
C104  Rating: 50V  [T_CAPC0603X33N]  (hidden comment: 1nF)
C105  Rating: 10V  [CAPMP3528X210N]  (hidden comment: 22uF)
C106  Rating: 16V  [T_CAPC0603X33N]  (hidden comment: 100nF)
C107  Rating: 16V  [T_CAPC0603X33N]  (hidden comment: 100nF)
JP14  826936-3  [T_TYCO_826936-3]  (value not drawn)
JP26  826936-3  [T_TYCO_826936-3]  (value not drawn)
L13  220R@100MHz  [INDC1608X95N]
L14  220R@100MHz  [INDC1608X95N]
L15  220R@100MHz  [INDC1608X95N]
R82  0R  [T_RESC0603X30N]
R83  0R  [T_RESC0603X30N]
R84  0R  [T_RESC0603X30N]
R85  0R  [T_RESC0603X30N]
R86  0R  [T_RESC0603X30N]
R273  0R  [T_RESC0603X30N]
R274  0R  [T_RESC0603X30N]
X1  Manufacturer Part No.: MM70-314-310B1  [T_JAE_MM70-314-310B1]  (hidden comment: CON-JAE-MM70-314-310B1-314-0.5mm)  (part I of 25)
X16  TSW-103-07-G-D  [T_Samtec_TSW-103-07-G-D]
X20  TSW-125-07-G-D  [T_SAMTEC_TSW-125-07-G-D]
X23  961105-6404-AR  [T_3M_961105-6404-AR]
X31  FH12-40S-0.5SV(55)  [T_Hirose_FH12-40S-0.5SV(55)]

### Blocks framed on the sheet
Share pads: R83-R86
Power: C98 C99 C105-C107 JP14 L13-L15

### Ports
AN1_TSWIP (bidir, see 15), GPIO[1..8] (bidir, see 10, 29, 4), I2C1[0..1] (bidir, see 25, 29, 5, 6), LCD1[0..29] (bidir, see 17, 22), SYSTEM_CTRL[0..3] (bidir, see 24, 29, 31, 4, 6)

### Nets
3.3V_DISP: C107.2 L14.2 X20.49
3.3V_SW: JP14.1 L14.1 R83.1 R84.1 X31.3(VCC) X31.4(VCC) X31.36(VDD)
5V_DISPINV: C105.1 C106.2 L13.2 X20.39 X23.1
5V_SW: JP14.3 L13.1
+V_DISPLAY: C98.2 C99.1 JP14.2 X20.28 X20.29
GND: C98.1 C99.2 C100.1 C101.1 C102.1 C103.1 C104.1 L15.1 R85.2 R86.1 X16.1 X20.1 X20.5 X20.12 X20.19 X20.26 X20.32 X20.41 X20.42 X31.1(VSS) X31.2(VSS) X31.14(VSS) X31.21(VSS) X31.29(VSS) X31.35(VSS)
GND_DISPINV: C105.2 C106.1 C107.1 L15.2 X20.38 X20.40 X23.2 X23.4
AN1_TSMX: C101.2 X1.317(AN1_TSMX) X16.3 X20.34 X31.38(XR)
AN1_TSMY: C100.2 X1.321(AN1_TSMY) X16.2 X20.33 X31.39(YD)
AN1_TSPX: C103.2 X1.315(AN1_TSPX) X16.5 X20.36 X31.40(XL)
AN1_TSPY: C102.2 X1.319(AN1_TSPY) X16.4 X20.35 X31.37(YU)
AN1_TSWIP: C104.2 JP26.1 X16.6 ; port AN1_TSWIP
BKL1_ON: X20.37 X23.3 X31.5(PWCTRL)
GPIO6: JP26.3
I2C1_SCL: R273.1
I2C1_SCL_GEN: R273.2 X20.30
I2C1_SDA: R274.1
I2C1_SDA_GEN: R274.2 X20.31
LCD1_B0: X20.47
LCD1_B1: X20.48
LCD1_B2: X20.20 X31.13(B0)
LCD1_B3: X20.21 X31.12(B1)
LCD1_B4: X20.22 X31.11(B2)
LCD1_B5: X20.23 X31.10(B3)
LCD1_B6: X20.24 X31.9(B4)
LCD1_B7: X20.25 X31.8(B5)
LCD1_CONF1: R83.2 R85.1 X31.33(NC)
LCD1_CONF2: R84.2 R86.2 X31.34(SHUT)
LCD1_DE: X20.27 X31.32(ENB)
LCD1_G0: X20.45
LCD1_G1: X20.46
LCD1_G2: X20.13 X31.20(G0)
LCD1_G3: X20.14 X31.19(G1)
LCD1_G4: X20.15 X31.18(G2)
LCD1_G5: X20.16 X31.17(G3)
LCD1_G6: X20.17 X31.16(G4)
LCD1_G7: X20.18 X31.15(G5)
LCD1_HSYNC: X20.3 X31.30(HSYNC)
LCD1_PCLK: X20.2 X31.28(DCLK)
LCD1_R0: X20.43
LCD1_R1: X20.44
LCD1_R2: X20.6 X31.27(R0)
LCD1_R3: X20.7 X31.26(R1)
LCD1_R4: X20.8 X31.25(R2)
LCD1_R5: X20.9 X31.24(R3)
LCD1_R6: X20.10 X31.23(R4)
LCD1_R7: X20.11 X31.22(R5)
LCD1_VSYNC: X20.4 X31.31(VSYNC)
PWM_BKL1: X31.6(LEDCTRL)
RESET_MOCI#: R82.1
RESET_MOCI_EDT#: R82.2 X31.7(RESET#)
NetJP26_2: JP26.2 X20.50

Not connected (* = marked no-connect by the designer): X23 5*

### Buses and harness runs
bus AN1_TOUCH[0..3]
bus GPIO[1..8] = port GPIO[1..8]
bus I2C1[0..1] = port I2C1[0..1]
bus LCD1[0..29] = port LCD1[0..29]
bus SYSTEM_CTRL[0..3] = port SYSTEM_CTRL[0..3]

### Notes on the sheet
- (near X23) LCD inverter  (fits for GH025A(P1))
- (near X23) 2.54mm Male
- (near X31) Unified Interface EDT Display Connector
- Generic Display Connector
- 2.54mm Male
- Generic Touch Connector
- (near X16) 2.54mm Male
- Title
- Size:
- Date:
- A3
- Number:
- Time:
- Revision:
- Sheet
- of
- File:
- (in symbol C-TA-22uF-10V-20%-3528) +
- (in symbol CON-JAE-MM70-314-310B1-314-0.5mm, part I) Apalis - Touch; 9 of 25

### Library data of the parts
C98 C106 C107 = C-X7R-100nF-16V-10%-0603: Capacitor Ceramic X7R 100nF 16V 10% 0603; Tolerance: 10%; Type: X7R; Value: 100nF
C99 C105 = C-TA-22uF-10V-20%-3528: Capacitor TA 22uF 10V 20% 3528; Tolerance: 20%; Type: TA; Value: 22uF
C100-C104 = C-X7R-1nF-50V-10%-0603: Capacitor Ceramic X7R 1nF 50V 10% 0603; Tolerance: 10%; Type: X7R; Value: 1nF
JP14 = CON-Tyco-826936-3-1X3-2.54mm-JP: Jumper, 3-Pin; Manufacturer Name: Tyco; No. of ways: 1X3; Pitch: 2.54mm; Manufacturer Part No.: 826936-3
JP26 = CON-Tyco-826936-3-1X3-2.54mm-JP_1: Jumper, 3-Pin; Manufacturer Name: Tyco; No. of ways: 1X3; Pitch: 2.54mm; Manufacturer Part No.: 826936-3
L13-L15 = L-220R@100MHz-2A-25%-0603: 220R@100MHz 2A EMI FILTER; Tolerance: 25%; Rating: 2A; Value: 220R@100MHz
R82-R86 R273 R274 = R-0R-63mW-1%-0603: Resistor 0 ohm 63mW 1% 0603; Rating: 63mW; Tolerance: 1%; Value: 0R
X1 = CON-JAE-MM70-314-310B1-314-0.5mm: MXM3 Connector; Manufacturer Name: JAE; No. of ways: 314
X16 = CON-Samtec-TSW-103-07-G-D: Header Male, 2x3 Pins, 2.54mm pitch; Manufacturer Name: Samtec; No. of. ways: 2x3; Pitch: 2.54mm; Manufacturer Part No.: TSW-103-07-G-D
X20 = CON-Samtec-TSW-125-07-G-D: Header, 2x25 Pins, 2.54 mm pitch; Manufacturer Name: Samtec; Pitch: 2.54mm; No. of ways: 2x25; Manufacturer Part No.: TSW-125-07-G-D
X23 = CON-3M-961105-6404-AR: Audio Header 5 pins 2.54mm; Manufacturer Name: 3M; No. of ways: 1X5; Pitch: 2.54mm; Manufacturer Part No.: 961105-6404-AR
X31 = CON-Hirose-FH12-40S-0.5SV(55)-0.5mm: 0.50mm Pitch FFC/FPC Vertical RGB connector; Manufacturer Name: Hirose; No. of ways: 24; Pitch: 0.5mm; Manufacturer Part No.: FH12-40S-0.5SV(55)

## Sheet RTC.SchDoc: Apalis Evaluation Board 1.1
size A3; Organization: Toradex AG; Address1: Altsagenstrasse 5; Address2: Horw; Address3: 6048; Address4: Switzerland; DocumentNumber: 5; Revision: V1.1; SheetNumber: 5; SheetTotal: 32; PageSetup: Record=PageOptions|CenterHorizontal=True|CenterVertical=True|PrintScale=0.73|XCorrection=1.00|YCorrection=1.00|PrintKind=0|BorderSize=5000000|LeftOffset=0|BottomOffset=0|Orientation=2|PaperLength=1000|PaperWidth=1000|Scale=100|PaperSource=7|PrintQuality=-4|MediaType=1|DitherType=10|PaperKind=A4|PrintScaleMode=1
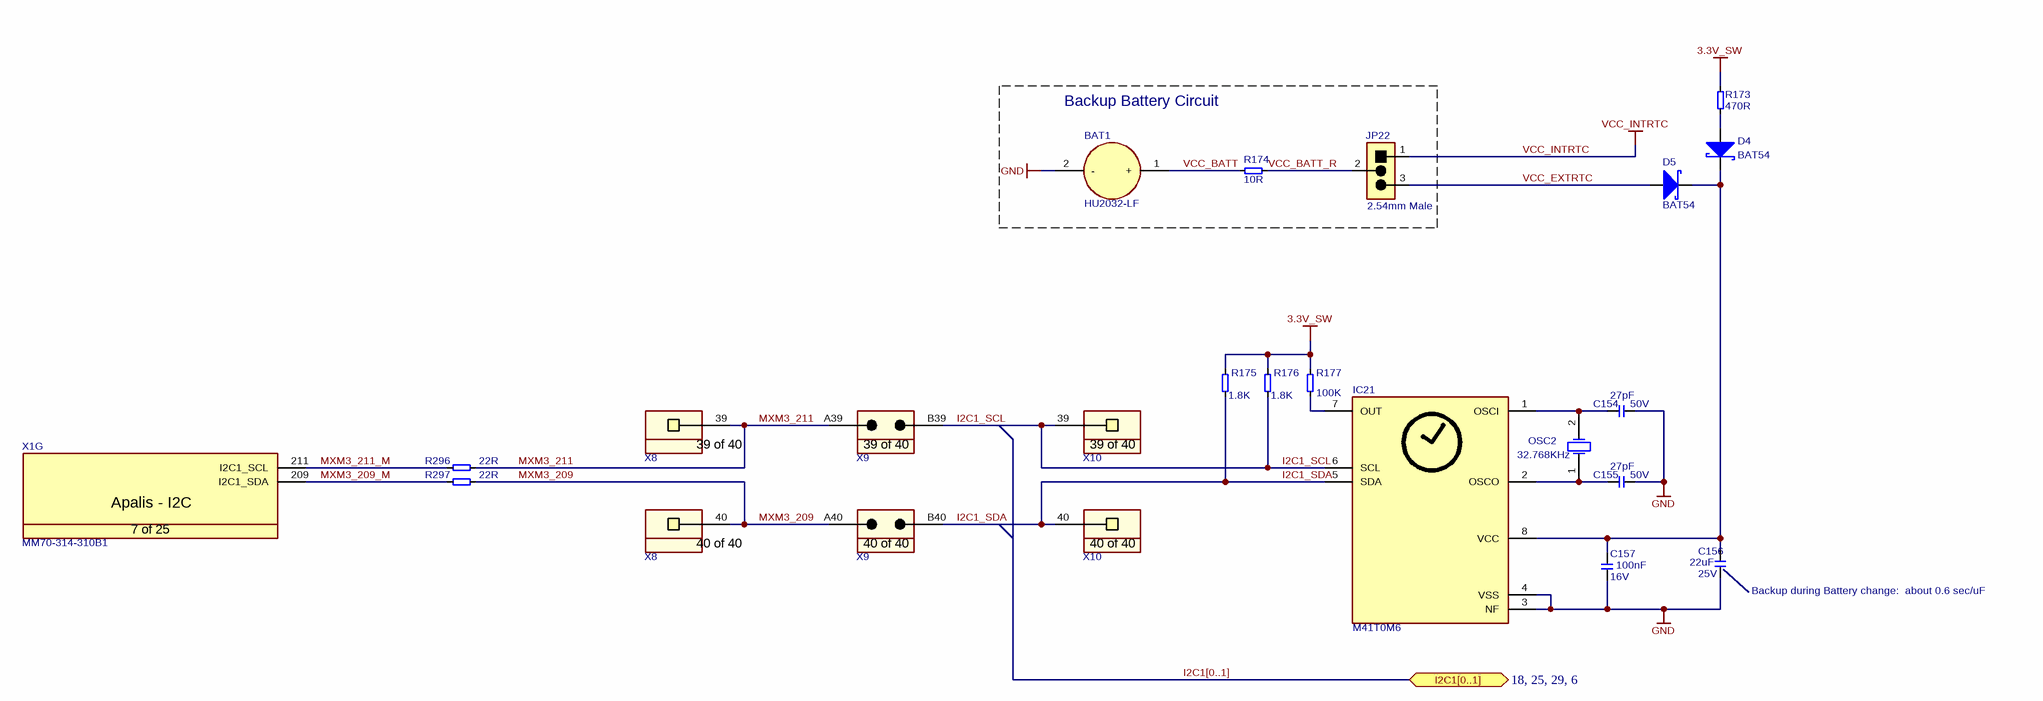
[diagram p16: RTC.SchDoc]

### Parts
BAT1  HU2032-LF  [T_Renata_HU2032-LF]
C154  Rating: 50V  [T_CAPC0603X33N]  (hidden comment: 27pF)
C155  Rating: 50V  [T_CAPC0603X33N]  (hidden comment: 27pF)
C156  Rating: 25V  [CAPC3225X160N]  (hidden comment: 22uF)
C157  Rating: 16V  [T_CAPC0603X33N]  (hidden comment: 100nF)
D4  BAT54  [SOT95P230X110-3N]
D5  BAT54  [SOT95P230X110-3N]
IC21  M41T0M6  [SOIC127P600X173-8N]
JP22  826936-3  [T_TYCO_826936-3]  (value not drawn)
OSC2  value 32.768KHz  [T_MC_CC4V-T1A]  (hidden comment: CC4V-T1A)
R173  470R  [T_RESC0603X30N]
R174  10R  [t_RESC0603X30N]
R175  1.8K  [T_RESC0603X30N]
R176  1.8K  [T_RESC0603X30N]
R177  100K  [t_RESC0603X30N]
R296  22R  [RESC1005X40N]
R297  22R  [RESC1005X40N]
X1  Manufacturer Part No.: MM70-314-310B1  [T_JAE_MM70-314-310B1]  (hidden comment: CON-JAE-MM70-314-310B1-314-0.5mm)  (part G of 25)
X8  SSW-110-01-G-S  [T_Samtec_SSW-110-01-G-S]  (value not drawn)  (parts 39,40 of 40)
X9  TSW-110-07-G-D  [T_Samtec_TSW-110-07-G-D]  (value not drawn)  (parts 39,40 of 40)
X10  SSW-110-01-G-S  [T_Samtec_SSW-110-01-G-S]  (value not drawn)  (parts 39,40 of 40)

### Blocks framed on the sheet
Backup Battery Circuit: BAT1 JP22 R174

### Ports
I2C1[0..1] (bidir, see 18, 25, 29, 6)

### Nets
3.3V_SW: R173.2 R175.2 R176.2 R177.2
GND: BAT1.2(-) C154.2 C155.2 C156.1 C157.1 IC21.3(NF) IC21.4(VSS)
VCC_INTRTC: JP22.1
I2C1_SCL: IC21.6(SCL) R176.1 X9.B39 X10.39
I2C1_SDA: IC21.5(SDA) R175.1 X9.B40 X10.40
MXM3_209: R297.2 X8.40 X9.A40
MXM3_209_M: R297.1 X1.209(I2C1_SDA)
MXM3_211: R296.2 X8.39 X9.A39
MXM3_211_M: R296.1 X1.211(I2C1_SCL)
VCC_BATT: BAT1.1(+) R174.1
VCC_BATT_R: JP22.2 R174.2
VCC_EXTRTC: D5.1 JP22.3
NetC154_1: C154.1 IC21.1(OSCI) OSC2.2(OSC2)
NetC155_1: C155.1 IC21.2(OSCO) OSC2.1(OSC1)
NetC156_2: C156.2 C157.2 D4.3 D5.3 IC21.8(VCC)
NetD4_1: D4.1 R173.1
NetIC21_7: IC21.7(OUT) R177.1

### Buses and harness runs
bus I2C1[0..1] = port I2C1[0..1]

### Notes on the sheet
- (near JP22) 2.54mm Male
- (near C156) Backup during Battery change:  about 0.6 sec/uF
- Title
- Size:
- Date:
- A3
- Number:
- Time:
- Revision:
- Sheet
- of
- File:
- (in symbol CON-JAE-MM70-314-310B1-314-0.5mm, part G) Apalis - I2C; 7 of 25
- (in symbol CON-Samtec-SSW-110-01-G-S, part 39) 39 of 40
- (in symbol CON-Samtec-SSW-110-01-G-S, part 40) 40 of 40
- (in symbol CON-Samtec-TSW-110-07-G-D, part 39) 39 of 40
- (in symbol CON-Samtec-TSW-110-07-G-D, part 40) 40 of 40

### Library data of the parts
BAT1 = BAT-Renata-HU2032-LF: C2032 Battery Holder; Manufacturer Name: Renata; Manufacturer Part No.: HU2032-LF
C154 C155 = C-NPO-27pF-50V-5%-0603: Capacitor Ceramic NPO 27pF 50V 5% 0603; Tolerance: 5%; Type: NPO; Value: 27pF
C156 = C-X5R-22uF-25V-20%-1210: Capacitor Ceramic X5R 22uF 25V 20% 1210; Tolerance: 20%; Type: X5R; Value: 22uF
C157 = C-X7R-100nF-16V-10%-0603: Capacitor Ceramic X7R 100nF 16V 10% 0603; Tolerance: 10%; Type: X7R; Value: 100nF
D4 D5 = D-Philips-BAT54-Schottky: BAT54 Schottky Diode; Manufacturer Name: Philips; Manufacturer Part No.: BAT54
IC21 = IC-ST-M41T0M6: RTC M41T0M6; Manufacturer Name: ST; Manufacturer Part No.: M41T0M6
JP22 = CON-Tyco-826936-3-1X3-2.54mm-JP_1: as JP26 on sheet RGB_Displays; Manufacturer Part No.: 826936-3
OSC2 = OSC-MC-CC4V-T1A-32.768KHz-30ppm-5x1.9mm: Quartz 32.768kHz; Manufacturer Name: Micro Crystal; Tolerance: 30ppm; Manufacturer Part No.: CC4V-T1A
R173 = R-470R-63mW-5%-0603: Resistor 470 ohm 63mW 5% 0603; Rating: 63mW; Tolerance: 5%; Value: 470R
R174 = R-10R-63mW-5%-0603: Resistor 10 ohm 63mW 5% 0603; Rating: 63mW; Tolerance: 5%; Value: 10R
R175 R176 = R-1.8KR-63mW-5%-0603: Resistor 1.8 Kohm 63mW 5% 0603; Value: 1.8KR; Rating: 63mW; Tolerance: 5%
R177 = R-100KR-63mW-5%-0603: Resistor 100 Kohm 63mW 5% 0603; Value: 100KR; Rating: 63mW; Tolerance: 5%
R296 R297 = R-22R-63mW-5%-0402: Resistor 22 ohm 63mW 5% 0402; Rating: 63mW; Tolerance: 5%; Value: 22R
X1 = CON-JAE-MM70-314-310B1-314-0.5mm: as X1 on sheet RGB_Displays
X8 X10 = CON-Samtec-SSW-110-01-G-S: Receptacle Female Socket 1x40 pin 2.54mm pitch; Manufacturer Name: Samtec; Pitch: 2.54mm; No. of ways: 1x40; Manufacturer Part No.: SSW-110-01-G-S
X9 = CON-Samtec-TSW-110-07-G-D: Header 2x40 pin 2.54mm pitch; Manufacturer Name: Samtec; Pitch: 2.54mm; No. of ways: 2x40; Manufacturer Part No.: TSW-110-07-G-D

## Sheet Sata.SCHDOC: Apalis Evaluation Board 1.1
size A3; Organization: Toradex AG; Address1: Altsagenstrasse 5; Address2: Horw; Address3: 6048; Address4: Switzerland; DocumentNumber: 25; Revision: V1.1; SheetNumber: 25; SheetTotal: 32; PageSetup: Record=PageOptions|CenterHorizontal=True|CenterVertical=True|PrintScale=0.73|XCorrection=1.00|YCorrection=1.00|PrintKind=0|BorderSize=5000000|LeftOffset=0|BottomOffset=0|Orientation=2|PaperLength=1000|PaperWidth=1000|Scale=100|PaperSource=7|PrintQuality=-4|MediaType=1|DitherType=10|PaperKind=A4|PrintScaleMode=1
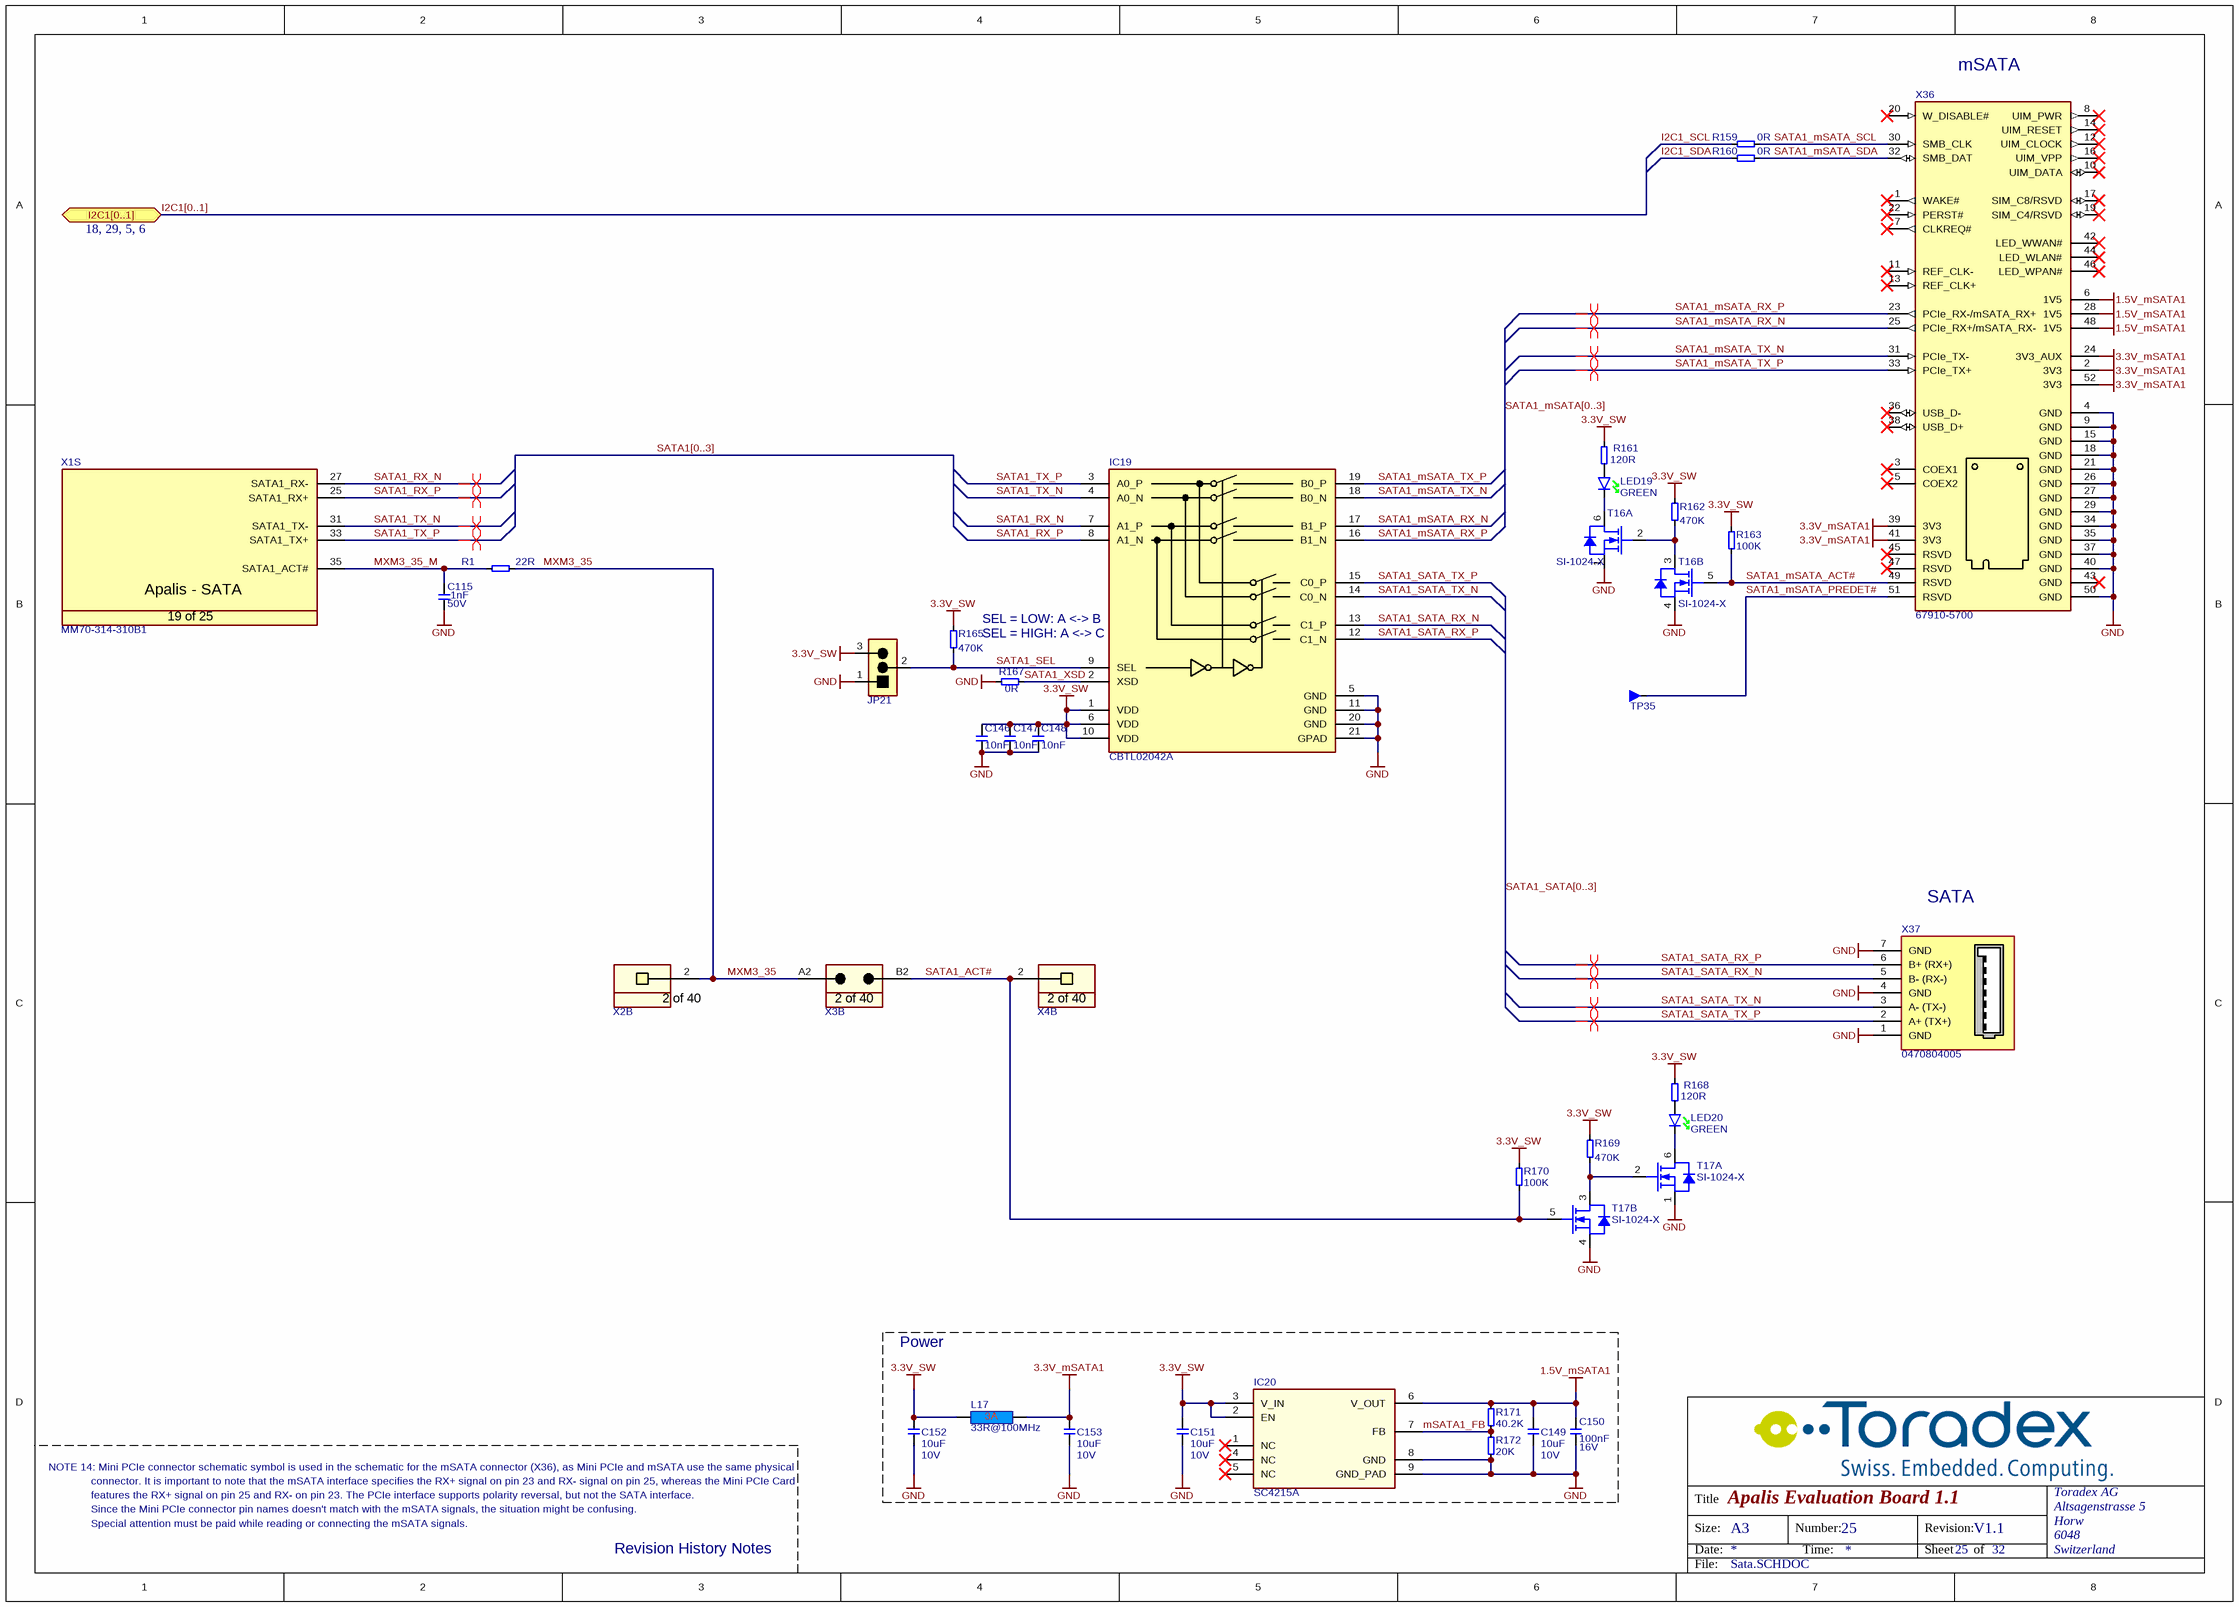
[diagram p17: Sata.SCHDOC]

### Parts
C115  Rating: 50V  [CAPC1005X60N]  (hidden comment: 1nF)
C146  10nF  [T_CAPC0603X33N]
C147  10nF  [T_CAPC0603X33N]
C148  10nF  [T_CAPC0603X33N]
C149  Rating: 10V  [T_CAPC0603X33N]  (hidden comment: 10uF)
C150  Rating: 16V  [T_CAPC0603X33N]  (hidden comment: 100nF)
C151  Rating: 10V  [T_CAPC0603X33N]  (hidden comment: 10uF)
C152  Rating: 10V  [T_CAPC0603X33N]  (hidden comment: 10uF)
C153  Rating: 10V  [T_CAPC0603X33N]  (hidden comment: 10uF)
IC19  CBTL02042A  [QFN50P250X450X100-20N]
IC20  Part No.: SC4215A  [SOIC127P650X175_HS-8N]  (hidden comment: IC-Semtech-SC4215A)
JP21  826936-3  [T_TYCO_826936-3]  (value not drawn)
L17  33R@100MHz  [INDC1608X95N]
LED19  Color: GREEN  [T_Osram_T670_GREEN]  (hidden comment: LG T670-K1L2-1)
LED20  Color: GREEN  [T_Osram_T670_GREEN]  (hidden comment: LG T670-K1L2-1)
R1  22R  [RESC1005X40N]
R159  0R  [T_RESC0603X30N]
R160  0R  [T_RESC0603X30N]
R161  120R  [T_RESC0603X30N]
R162  470K  [T_RESC0603X30N]
R163  100K  [T_RESC0603X30N]
R165  470K  [T_RESC0603X30N]
R167  0R  [T_RESC0603X30N]
R168  120R  [T_RESC0603X30N]
R169  470K  [T_RESC0603X30N]
R170  100K  [T_RESC0603X30N]
R171  40.2K  [T_RESC0603X30N]
R172  20K  [T_RESC0603X30N]
T16  Manufacturer Part No.: SI-1024-X  [SOTFL50P160X60-6N]  (hidden comment: T-Vishay-SI-1024X-N)  (parts A,B of 2)
T17  Manufacturer Part No.: SI-1024-X  [SOTFL50P160X60-6N]  (hidden comment: T-Vishay-SI-1024X-N)  (parts A,B of 2)
TP35  Testpin  [T_TP-THT]  (value not drawn)
X1  Manufacturer Part No.: MM70-314-310B1  [T_JAE_MM70-314-310B1]  (hidden comment: CON-JAE-MM70-314-310B1-314-0.5mm)  (part S of 25)
X2  SSW-110-01-G-S  [T_Samtec_SSW-110-01-G-S]  (value not drawn)  (part B of 40)
X3  TSW-110-07-G-D  [T_Samtec_TSW-110-07-G-D]  (value not drawn)  (part B of 40)
X4  SSW-110-01-G-S  [T_Samtec_SSW-110-01-G-S]  (value not drawn)  (part B of 40)
X36  67910-5700  [T_Molex_67910-5700]
X37  0470804005  [T_Molex_47080-4005]

### Blocks framed on the sheet
Power: C149-C153 IC20 L17 R171 R172

### Ports
I2C1[0..1] (bidir, see 18, 29, 5, 6)

### Nets
1.5V_mSATA1: C149.2 C150.2 IC20.6(V_OUT) R171.2 X36.6(1V5) X36.28(1V5) X36.48(1V5)
3.3V_mSATA1: C153.2 L17.2 X36.2(3V3) X36.24(3V3_AUX) X36.39(3V3) X36.41(3V3) X36.52(3V3)
3.3V_SW: C146.2 C147.2 C148.2 C151.2 C152.2 IC19.1(VDD) IC19.6(VDD) IC19.10(VDD) IC20.2(EN) IC20.3(V_IN) JP21.3 L17.1 R161.2 R162.1 R163.2 R165.1 R168.2 R169.1 R170.2
GND: C115.1 C146.1 C147.1 C148.1 C149.1 C150.1 C151.1 C152.1 C153.1 IC19.5(GND) IC19.11(GND) IC19.20(GND) IC19.21(GPAD) IC20.8(GND) IC20.9(GND_PAD) JP21.1 R167.1 R172.1 T16.1(S) T16.4(S) T17.1(S) T17.4(S) X36.4(GND) X36.9(GND) X36.15(GND) X36.18(GND) X36.21(GND) X36.26(GND) X36.27(GND) X36.29(GND) X36.34(GND) X36.35(GND) X36.37(GND) X36.40(GND) X36.50(GND) X37.1(GND) X37.4(GND) X37.7(GND)
I2C1_SCL: R159.1
I2C1_SDA: R160.1
mSATA1_FB: IC20.7(FB) R171.1 R172.2
MXM3_35: R1.2 X2.2 X3.A2
MXM3_35_M: C115.2 R1.1 X1.35(SATA1_ACT#)
SATA1_ACT#: R170.1 T17.5(G) X3.B2 X4.2
SATA1_mSATA_ACT#: R163.1 T16.5(G) X36.49(RSVD)
SATA1_mSATA_PREDET#: TP35.1 X36.51(RSVD)
SATA1_mSATA_RX_N: IC19.17(B1_P) X36.25(PCIe_RX+/mSATA_RX-)
SATA1_mSATA_RX_P: IC19.16(B1_N) X36.23(PCIe_RX-/mSATA_RX+)
SATA1_mSATA_SCL: R159.2 X36.30(SMB_CLK)
SATA1_mSATA_SDA: R160.2 X36.32(SMB_DAT)
SATA1_mSATA_TX_N: IC19.18(B0_N) X36.31(PCIe_TX-)
SATA1_mSATA_TX_P: IC19.19(B0_P) X36.33(PCIe_TX+)
SATA1_RX_N: IC19.7(A1_P) X1.27(SATA1_RX-)
SATA1_RX_P: IC19.8(A1_N) X1.25(SATA1_RX+)
SATA1_SATA_RX_N: IC19.13(C1_P) X37.5(B-_(RX-))
SATA1_SATA_RX_P: IC19.12(C1_N) X37.6(B+_(RX+))
SATA1_SATA_TX_N: IC19.14(C0_N) X37.3(A-_(TX-))
SATA1_SATA_TX_P: IC19.15(C0_P) X37.2(A+_(TX+))
SATA1_SEL: IC19.9(SEL) JP21.2 R165.2
SATA1_TX_N: IC19.4(A0_N) X1.31(SATA1_TX-)
SATA1_TX_P: IC19.3(A0_P) X1.33(SATA1_TX+)
SATA1_XSD: IC19.2(XSD) R167.2
NetLED19_A: LED19.A R161.1
NetLED19_K: LED19.K T16.6(D)
NetLED20_A: LED20.A R168.1
NetLED20_K: LED20.K T17.6(D)
NetR162_2: R162.2 T16.2(G) T16.3(D)
NetR169_2: R169.2 T17.2(G) T17.3(D)

Not connected (* = marked no-connect by the designer): IC20 1(NC)* 4(NC)* 5(NC)*; X36 1(WAKE#)* 3(COEX1)* 5(COEX2)* 7(CLKREQ#)* 8(UIM_PWR)* 10(UIM_DATA)* 11(REF_CLK-)* 12(UIM_CLOCK)* 13(REF_CLK+)* 14(UIM_RESET)* 16(UIM_VPP)* 17(SIM_C8/RSVD)* 19(SIM_C4/RSVD)* 20(W_DISABLE#)* 22(PERST#)* 36(USB_D-)* 38(USB_D+)* 42(LED_WWAN#)* 43(GND)* 44(LED_WLAN#)* 45(RSVD)* 46(LED_WPAN#)* 47(RSVD)*

### Buses and harness runs
bus I2C1[0..1] = port I2C1[0..1]
bus SATA1[0..3]
bus SATA1_mSATA[0..3]
bus SATA1_SATA[0..3]

### Layout directives
differential pair: SATA1_mSATA_RX_N, SATA1_mSATA_RX_P, SATA1_mSATA_TX_N, SATA1_mSATA_TX_P, SATA1_RX_N, SATA1_RX_P, SATA1_SATA_RX_N, SATA1_SATA_RX_P, SATA1_SATA_TX_N, SATA1_SATA_TX_P, SATA1_TX_N, SATA1_TX_P

### Notes on the sheet
- (near X36) mSATA
- (near IC19) SEL = LOW: A <-> B
- (near IC19) SEL = HIGH: A <-> C
- (near X37) SATA
- NOTE 14: Mini PCIe connector schematic symbol is used in the schematic for the mSATA connector (X36), as Mini PCIe and mSATA use the same physical
- connector. It is important to note that the mSATA interface specifies the RX+ signal on pin 23 and RX- signal on pin 25, whereas the Mini PCIe Card
- Since the Mini PCIe connector pin names doesn't match with the mSATA signals, the situation might be confusing.
- features the RX+ signal on pin 25 and RX- on pin 23. The PCIe interface supports polarity reversal, but not the SATA interface.
- Special attention must be paid while reading or connecting the mSATA signals.
- Revision History Notes
- Title
- Size:
- Date:
- A3
- Number:
- Time:
- Revision:
- Sheet
- of
- File:
- (in symbol CON-JAE-MM70-314-310B1-314-0.5mm, part S) Apalis - SATA; 19 of 25
- (in symbol CON-Samtec-SSW-110-01-G-S, part B) 2 of 40
- (in symbol CON-Samtec-TSW-110-07-G-D, part B) 2 of 40

### Library data of the parts
C115 = C-X7R-1nF-50V-10%-0402: Capacitor Ceramic X7R 1nF 50V 10% 0402; Tolerance: 10%; Type: X7R; Value: 1nF
C146-C148 = C-X7R-10nF-25V-10%-0603: Capacitor Ceramic X7R 10nF 25V 10% 0603; Tolerance: 10%; Type: X7R; Value: 10nF
C149 C151-C153 = C-X5R-10uF-10V-20%-0603: Capacitor Ceramic X5R 10uF 10V 20% 0603; Tolerance: 20%; Type: X5R; Value: 10uF
C150 = C-X7R-100nF-16V-10%-0603: Capacitor Ceramic X7R 100nF 16V 10% 0603; Tolerance: 10%; Type: X7R; Value: 100nF
IC19 = IC-NXP-CBTL02042A: Analog Switch CBTL02042A; Manufacturer Name: NXP; Manufacturer Part No.: CBTL02042A
IC20 = IC-Semtech-SC4215A: LDO TO 2A; Manufacturer Name: Semtech
JP21 = CON-Tyco-826936-3-1X3-2.54mm-JP_1: as JP26 on sheet RGB_Displays; Manufacturer Part No.: 826936-3
L17 = L-33R@100MHz-3A-25%-0603: 33R@100MHz 3A EMI FILTER; Tolerance: 25%; Rating: 3A; Value: 33R@100MHz
LED19 LED20 = LED-Osram-T670-K1L2-1: LED green Osram LG T670-K1L2-1; Manufacturer Name: Osram; Manufacturer Part No.: LG T670-K1L2-1
R1 = R-22R-63mW-5%-0402: Resistor 22 ohm 63mW 5% 0402; Rating: 63mW; Tolerance: 5%; Value: 22R
R159 R160 R167 = R-0R-63mW-1%-0603: Resistor 0 ohm 63mW 1% 0603; Rating: 63mW; Tolerance: 1%; Value: 0R
R161 R168 = R-120R-63mW-5%-0603: Resistor 120 ohm 63mW 5% 0603; Rating: 63mW; Tolerance: 5%; Value: 120R
R162 R165 R169 = R-470KR-63mW-5%-0603: Resistor 470 Kohm 63mW 5% 0603; Value: 470KR; Rating: 63mW; Tolerance: 5%
R163 R170 = R-100KR-63mW-5%-0603: as R177 on sheet RTC; Rating: 63mW; Tolerance: 5%
R171 = R-40.2KR-63mW-1%-0603: Resistor 40.2 Kohm 63mW 1% 0603; Value: 40.2KR; Rating: 63mW; Tolerance: 1%
R172 = R-20KR-63mW-1%-0603: Resistor 20 Kohm 63mW 1% 0603; Value: 20KR; Rating: 63mW; Tolerance: 1%
T16 T17 = T-Vishay-SI-1024X-N: Dual N-Channel 20V (D-S)  MOSFET; Manufacturer Name: Vishay
TP35 = Testpin: Testpin TH
X1 = CON-JAE-MM70-314-310B1-314-0.5mm: as X1 on sheet RGB_Displays
X2 X4 = CON-Samtec-SSW-110-01-G-S: as X8 on sheet RTC; Pitch: 2.54mm; No. of ways: 1x40; Manufacturer Part No.: SSW-110-01-G-S
X3 = CON-Samtec-TSW-110-07-G-D: as X9 on sheet RTC; Pitch: 2.54mm; No. of ways: 2x40; Manufacturer Part No.: TSW-110-07-G-D
X36 = CON-Molex-67910-5700: PCIe_Mini Card Holder; Manufacturer Name: Molex; Part No.: 67910-5700
X37 = CON-Molex-047080-4005: Sata Plugr SMD; Manufacturer name: Molex; Manufacturer Part No.: 47080-4005

## Sheet SPDIF.SchDoc: Apalis Evaluation Board 1.1
size A3; Organization: Toradex AG; Address1: Altsagenstrasse 5; Address2: Horw; Address3: 6048; Address4: Switzerland; DocumentNumber: 13; Revision: V1.1; SheetNumber: 13; SheetTotal: 32; PageSetup: Record=PageOptions|CenterHorizontal=True|CenterVertical=True|PrintScale=0.73|XCorrection=1.00|YCorrection=1.00|PrintKind=0|BorderSize=5000000|LeftOffset=0|BottomOffset=0|Orientation=2|PaperLength=1000|PaperWidth=1000|Scale=100|PaperSource=7|PrintQuality=-4|MediaType=1|DitherType=10|PaperKind=A4|PrintScaleMode=1
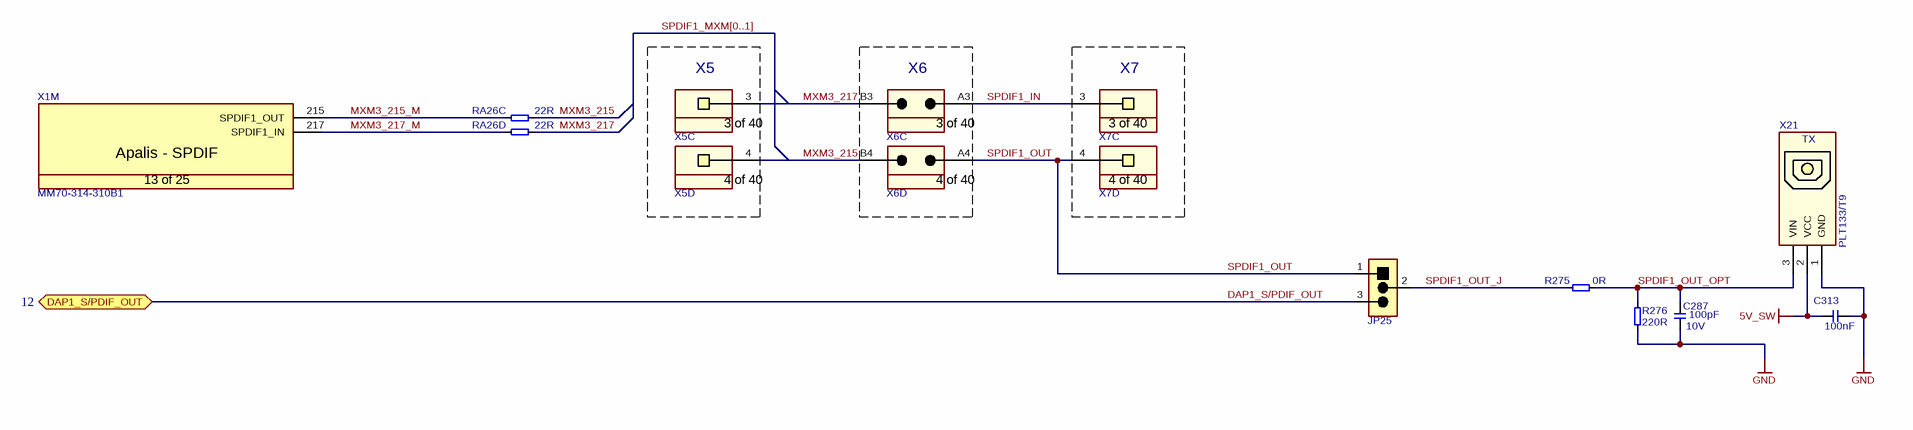
[diagram p18: SPDIF.SchDoc]

### Parts
C287  Rating: 10V  [T_CAPC0603X33N]  (hidden comment: 100pF)
C313  100nF  [T_CAPC0603X33N]
JP25  826936-3  [T_TYCO_826936-3]  (value not drawn)
R275  0R  [T_RESC0603X30N]
R276  220R  [T_RESC0603X30N]
RA26  22R  [T_Resistor_Array_X4]  (parts C,D of 4)
X1  Manufacturer Part No.: MM70-314-310B1  [T_JAE_MM70-314-310B1]  (hidden comment: CON-JAE-MM70-314-310B1-314-0.5mm)  (part M of 25)
X5  SSW-110-01-G-S  [T_Samtec_SSW-110-01-G-S]  (value not drawn)  (parts C,D of 40)
X6  TSW-110-07-G-D  [T_Samtec_TSW-110-07-G-D]  (value not drawn)  (parts C,D of 40)
X7  SSW-110-01-G-S  [T_Samtec_SSW-110-01-G-S]  (value not drawn)  (parts C,D of 40)
X21  PLT133/T9  [T_EVERLIGHT_PLT133/T9]

### Blocks framed on the sheet
X5: X5
X6: X6
X7: X7

### Ports
DAP1_S/PDIF_OUT (bidir, see 12)

### Nets
5V_SW: C313.1 X21.2(VCC)
GND: C287.1 C313.2 R276.1 X21.1(GND)
DAP1_S/PDIF_OUT: JP25.3 ; port DAP1_S/PDIF_OUT
MXM3_215: RA26.7 X5.4 X6.B4
MXM3_215_M: RA26.3 X1.215(SPDIF1_OUT)
MXM3_217: RA26.8 X5.3 X6.B3
MXM3_217_M: RA26.4 X1.217(SPDIF1_IN)
SPDIF1_IN: X6.A3 X7.3
SPDIF1_OUT: JP25.1 X6.A4 X7.4
SPDIF1_OUT_J: JP25.2 R275.1
SPDIF1_OUT_OPT: C287.2 R275.2 R276.2 X21.3(VIN)

### Buses and harness runs
bus SPDIF1_MXM[0..1]

### Notes on the sheet
- Title
- Size:
- Date:
- A3
- Number:
- Time:
- Revision:
- Sheet
- of
- File:
- (in symbol CON-JAE-MM70-314-310B1-314-0.5mm, part M) Apalis - SPDIF; 13 of 25
- (in symbol CON-Samtec-SSW-110-01-G-S, part C) 3 of 40
- (in symbol CON-Samtec-SSW-110-01-G-S, part D) 4 of 40
- (in symbol CON-Samtec-TSW-110-07-G-D, part C) 3 of 40
- (in symbol CON-Samtec-TSW-110-07-G-D, part D) 4 of 40
- (in symbol IF-Everlight-PLT133/T9) TX

### Library data of the parts
C287 = C-X7R-100pF-10V-20%-0603: Capacitor Ceramic X7R 100pF 10V 20% 0603; Tolerance: 20%; Type: X7R; Value: 100pF
C313 = C-X7R-100nF-16V-10%-0603: Capacitor Ceramic X7R 100nF 16V 10% 0603; Tolerance: 10%; Type: X7R; Value: 100nF
JP25 = CON-Tyco-826936-3-1X3-2.54mm-JP_1: as JP26 on sheet RGB_Displays; Manufacturer Part No.: 826936-3
R275 = R-0R-63mW-1%-0603: Resistor 0 ohm 63mW 1% 0603; Rating: 63mW; Tolerance: 1%; Value: 0R
R276 = R-220R-63mW-5%-0603: Resistor 220 ohm 63mW 5% 0603; Rating: 63mW; Tolerance: 5%; Value: 220R
RA26 = RA-22R-63mW-5%-1206-div: Resistor Array 22 R 63mW 5% 1206; Tolerance: 5%; Power Dissipation: 63mW; Value: 22R
X1 = CON-JAE-MM70-314-310B1-314-0.5mm: as X1 on sheet RGB_Displays
X5 X7 = CON-Samtec-SSW-110-01-G-S: as X8 on sheet RTC; Pitch: 2.54mm; No. of ways: 1x40; Manufacturer Part No.: SSW-110-01-G-S
X6 = CON-Samtec-TSW-110-07-G-D: as X9 on sheet RTC; Pitch: 2.54mm; No. of ways: 2x40; Manufacturer Part No.: TSW-110-07-G-D
X21 = IF-Everlight-PLT133/T9: Photolink- Fiber Optic Transmitter; No. of ways: 3; Manufacturer Name: Everlight; Manufacturer Part No.: PLT133/T9

## Sheet SPI.SCHDOC: Apalis Evaluation Board 1.1
size A3; Organization: Toradex AG; Address1: Altsagenstrasse 5; Address2: Horw; Address3: 6048; Address4: Switzerland; DocumentNumber: 28; Revision: V1.1; SheetNumber: 28; SheetTotal: 32; PageSetup: Record=PageOptions|CenterHorizontal=True|CenterVertical=True|PrintScale=0.73|XCorrection=1.00|YCorrection=1.00|PrintKind=0|BorderSize=5000000|LeftOffset=0|BottomOffset=0|Orientation=2|PaperLength=1000|PaperWidth=1000|Scale=100|PaperSource=7|PrintQuality=-4|MediaType=1|DitherType=10|PaperKind=A4|PrintScaleMode=1
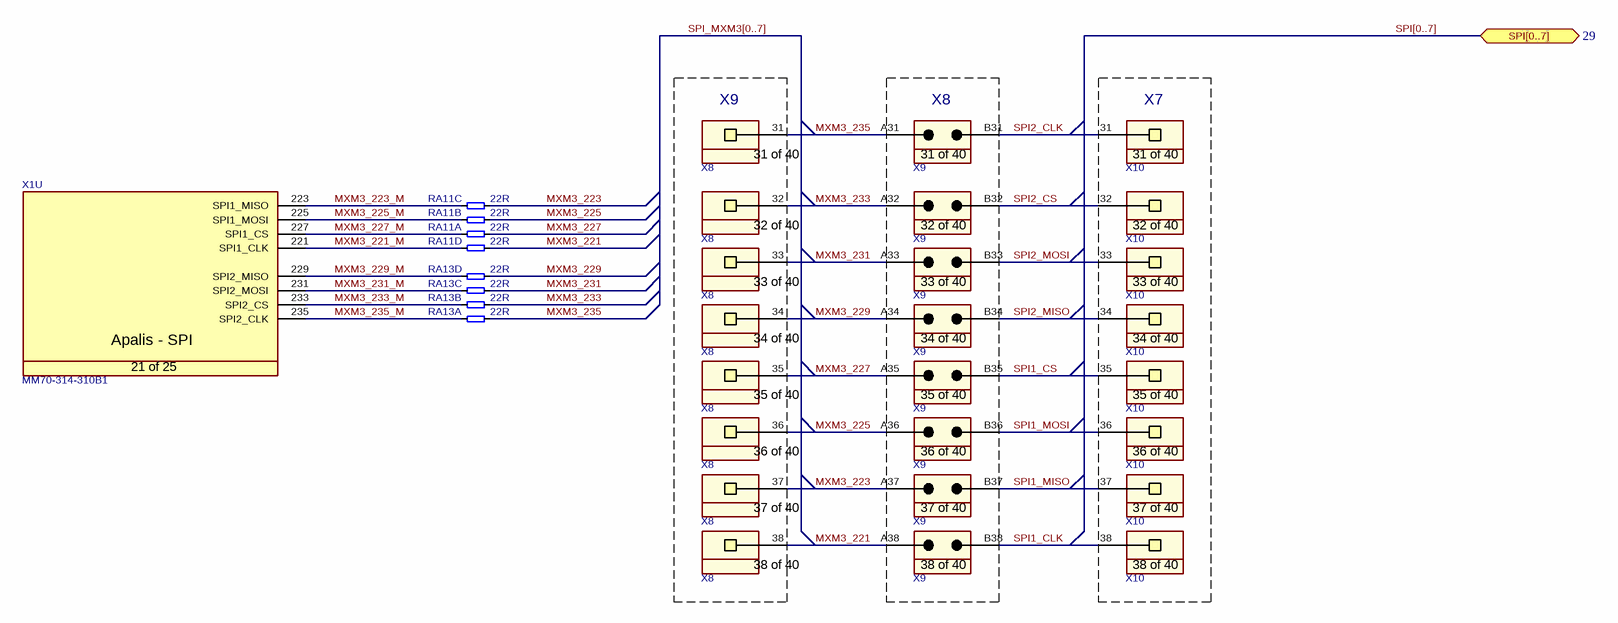
[diagram p19: SPI.SCHDOC]

### Parts
RA11  22R  [T_Resistor_Array_X4]  (parts A,B,C,D of 4)
RA13  22R  [T_Resistor_Array_X4]  (parts A,B,C,D of 4)
X1  Manufacturer Part No.: MM70-314-310B1  [T_JAE_MM70-314-310B1]  (hidden comment: CON-JAE-MM70-314-310B1-314-0.5mm)  (part U of 25)
X8  SSW-110-01-G-S  [T_Samtec_SSW-110-01-G-S]  (value not drawn)  (parts 31,32,33,34,35,36,37,38 of 40)
X9  TSW-110-07-G-D  [T_Samtec_TSW-110-07-G-D]  (value not drawn)  (parts 31,32,33,34,35,36,37,38 of 40)
X10  SSW-110-01-G-S  [T_Samtec_SSW-110-01-G-S]  (value not drawn)  (parts 31,32,33,34,35,36,37,38 of 40)

### Blocks framed on the sheet
X9: X8
X8: X9
X7: X10

### Ports
SPI[0..7] (bidir, see 29)

### Nets
MXM3_221: RA11.8 X8.38 X9.A38
MXM3_221_M: RA11.4 X1.221(SPI1_CLK)
MXM3_223: RA11.7 X8.37 X9.A37
MXM3_223_M: RA11.3 X1.223(SPI1_MISO)
MXM3_225: RA11.6 X8.36 X9.A36
MXM3_225_M: RA11.2 X1.225(SPI1_MOSI)
MXM3_227: RA11.5 X8.35 X9.A35
MXM3_227_M: RA11.1 X1.227(SPI1_CS)
MXM3_229: RA13.8 X8.34 X9.A34
MXM3_229_M: RA13.4 X1.229(SPI2_MISO)
MXM3_231: RA13.7 X8.33 X9.A33
MXM3_231_M: RA13.3 X1.231(SPI2_MOSI)
MXM3_233: RA13.6 X8.32 X9.A32
MXM3_233_M: RA13.2 X1.233(SPI2_CS)
MXM3_235: RA13.5 X8.31 X9.A31
MXM3_235_M: RA13.1 X1.235(SPI2_CLK)
SPI1_CLK: X9.B38 X10.38
SPI1_CS: X9.B35 X10.35
SPI1_MISO: X9.B37 X10.37
SPI1_MOSI: X9.B36 X10.36
SPI2_CLK: X9.B31 X10.31
SPI2_CS: X9.B32 X10.32
SPI2_MISO: X9.B34 X10.34
SPI2_MOSI: X9.B33 X10.33

### Buses and harness runs
bus SPI[0..7] = port SPI[0..7]
bus SPI_MXM3[0..7]

### Notes on the sheet
- Title
- Size:
- Date:
- A3
- Number:
- Time:
- Revision:
- Sheet
- of
- File:
- (in symbol CON-JAE-MM70-314-310B1-314-0.5mm, part U) Apalis - SPI; 21 of 25
- (in symbol CON-Samtec-SSW-110-01-G-S, part 31) 31 of 40
- (in symbol CON-Samtec-SSW-110-01-G-S, part 32) 32 of 40
- (in symbol CON-Samtec-SSW-110-01-G-S, part 33) 33 of 40
- (in symbol CON-Samtec-SSW-110-01-G-S, part 34) 34 of 40
- (in symbol CON-Samtec-SSW-110-01-G-S, part 35) 35 of 40
- (in symbol CON-Samtec-SSW-110-01-G-S, part 36) 36 of 40
- (in symbol CON-Samtec-SSW-110-01-G-S, part 37) 37 of 40
- (in symbol CON-Samtec-SSW-110-01-G-S, part 38) 38 of 40
- (in symbol CON-Samtec-TSW-110-07-G-D, part 31) 31 of 40
- (in symbol CON-Samtec-TSW-110-07-G-D, part 32) 32 of 40
- (in symbol CON-Samtec-TSW-110-07-G-D, part 33) 33 of 40
- (in symbol CON-Samtec-TSW-110-07-G-D, part 34) 34 of 40
- (in symbol CON-Samtec-TSW-110-07-G-D, part 35) 35 of 40
- (in symbol CON-Samtec-TSW-110-07-G-D, part 36) 36 of 40
- (in symbol CON-Samtec-TSW-110-07-G-D, part 37) 37 of 40
- (in symbol CON-Samtec-TSW-110-07-G-D, part 38) 38 of 40

### Library data of the parts
RA11 RA13 = RA-22R-63mW-5%-1206-div: Resistor Array 22 R 63mW 5% 1206; Tolerance: 5%; Power Dissipation: 63mW; Value: 22R
X1 = CON-JAE-MM70-314-310B1-314-0.5mm: as X1 on sheet RGB_Displays
X8 X10 = CON-Samtec-SSW-110-01-G-S: as X8 on sheet RTC; Pitch: 2.54mm; No. of ways: 1x40; Manufacturer Part No.: SSW-110-01-G-S
X9 = CON-Samtec-TSW-110-07-G-D: as X9 on sheet RTC; Pitch: 2.54mm; No. of ways: 2x40; Manufacturer Part No.: TSW-110-07-G-D

## Sheet Type_Specific.SchDoc: Apalis Evaluation Board 1.1
size A3; Organization: Toradex AG; Address1: Altsagenstrasse 5; Address2: Horw; Address3: 6048; Address4: Switzerland; DocumentNumber: 29; Revision: V1.1; SheetNumber: 29; SheetTotal: 32; PageSetup: Record=PageOptions|CenterHorizontal=True|CenterVertical=True|PrintScale=0.73|XCorrection=1.00|YCorrection=1.00|PrintKind=0|BorderSize=5000000|LeftOffset=0|BottomOffset=0|Orientation=2|PaperLength=1000|PaperWidth=1000|Scale=100|PaperSource=7|PrintQuality=-4|MediaType=1|DitherType=10|PaperKind=A4|PrintScaleMode=1
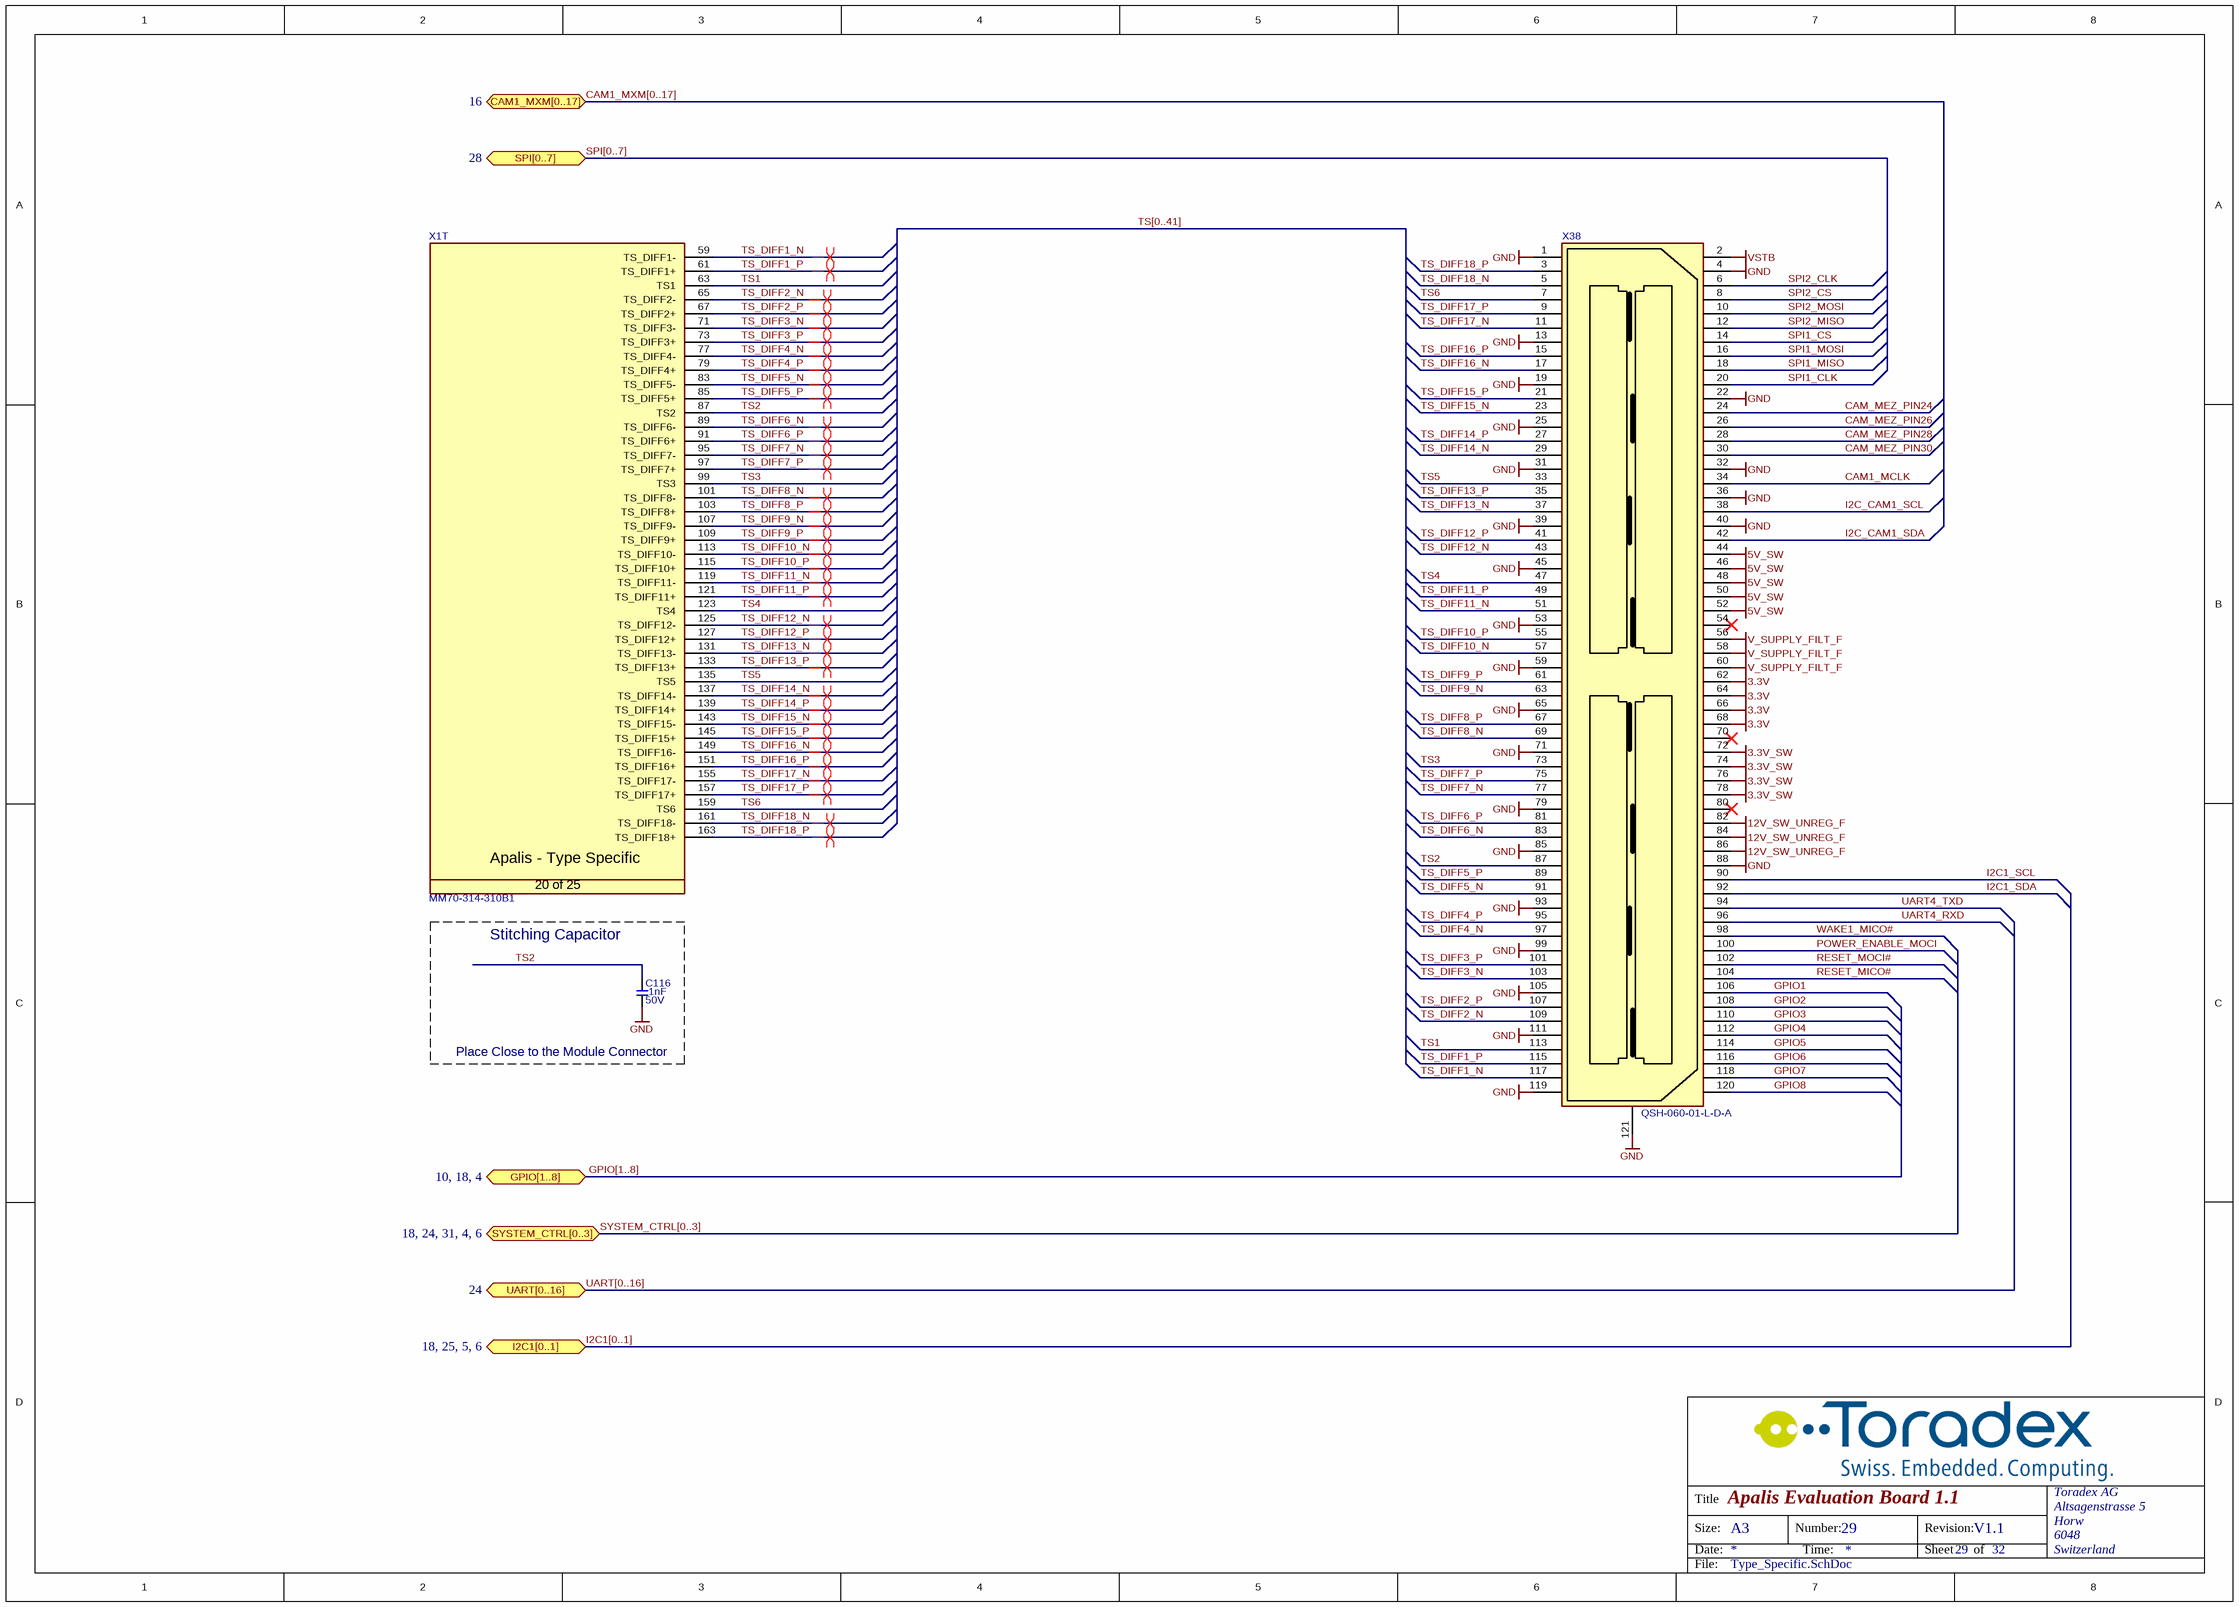
[diagram p20: Type_Specific.SchDoc]

### Parts
C116  Rating: 50V  [CAPC1005X60N]  (hidden comment: 1nF)
X1  Manufacturer Part No.: MM70-314-310B1  [T_JAE_MM70-314-310B1]  (hidden comment: CON-JAE-MM70-314-310B1-314-0.5mm)  (part T of 25)
X38  QSH-060-01-L-D-A  [T_Samtech_QSH-060-01-L-D-A]

### Blocks framed on the sheet
Stitching Capacitor: C116

### Ports
CAM1_MXM[0..17] (bidir, see 16), GPIO[1..8] (bidir, see 10, 18, 4), I2C1[0..1] (bidir, see 18, 25, 5, 6), SPI[0..7] (bidir, see 28), SYSTEM_CTRL[0..3] (bidir, see 18, 24, 31, 4, 6), UART[0..16] (bidir, see 24)

### Nets
3.3V: X38.62 X38.64 X38.66 X38.68
3.3V_SW: X38.72 X38.74 X38.76 X38.78
5V_SW: X38.44 X38.46 X38.48 X38.50 X38.52
12V_SW_UNREG_F: X38.82 X38.84 X38.86
GND: C116.1 X38.1 X38.4 X38.13 X38.19 X38.22 X38.25 X38.31 X38.32 X38.36 X38.39 X38.40 X38.45 X38.53 X38.59 X38.65 X38.71 X38.79 X38.85 X38.88 X38.93 X38.99 X38.105 X38.111 X38.119 X38.121
V_SUPPLY_FILT_F: X38.56 X38.58 X38.60
VSTB: X38.2
CAM1_MCLK: X38.34
CAM_MEZ_PIN24: X38.24
CAM_MEZ_PIN26: X38.26
CAM_MEZ_PIN28: X38.28
CAM_MEZ_PIN30: X38.30
GPIO1: X38.106
GPIO2: X38.108
GPIO3: X38.110
GPIO4: X38.112
GPIO5: X38.114
GPIO6: X38.116
GPIO7: X38.118
GPIO8: X38.120
I2C1_SCL: X38.90
I2C1_SDA: X38.92
I2C_CAM1_SCL: X38.38
I2C_CAM1_SDA: X38.42
POWER_ENABLE_MOCI: X38.100
RESET_MICO#: X38.104
RESET_MOCI#: X38.102
SPI1_CLK: X38.20
SPI1_CS: X38.14
SPI1_MISO: X38.18
SPI1_MOSI: X38.16
SPI2_CLK: X38.6
SPI2_CS: X38.8
SPI2_MISO: X38.12
SPI2_MOSI: X38.10
TS1: X1.63(TS1) X38.113
TS2: C116.2 X1.87(TS2) X38.87
TS3: X1.99(TS3) X38.73
TS4: X1.123(TS4) X38.47
TS5: X1.135(TS5) X38.33
TS6: X1.159(TS6) X38.7
TS_DIFF1_N: X1.59(TS_DIFF1-) X38.117
TS_DIFF1_P: X1.61(TS_DIFF1+) X38.115
TS_DIFF2_N: X1.65(TS_DIFF2-) X38.109
TS_DIFF2_P: X1.67(TS_DIFF2+) X38.107
TS_DIFF3_N: X1.71(TS_DIFF3-) X38.103
TS_DIFF3_P: X1.73(TS_DIFF3+) X38.101
TS_DIFF4_N: X1.77(TS_DIFF4-) X38.97
TS_DIFF4_P: X1.79(TS_DIFF4+) X38.95
TS_DIFF5_N: X1.83(TS_DIFF5-) X38.91
TS_DIFF5_P: X1.85(TS_DIFF5+) X38.89
TS_DIFF6_N: X1.89(TS_DIFF6-) X38.83
TS_DIFF6_P: X1.91(TS_DIFF6+) X38.81
TS_DIFF7_N: X1.95(TS_DIFF7-) X38.77
TS_DIFF7_P: X1.97(TS_DIFF7+) X38.75
TS_DIFF8_N: X1.101(TS_DIFF8-) X38.69
TS_DIFF8_P: X1.103(TS_DIFF8+) X38.67
TS_DIFF9_N: X1.107(TS_DIFF9-) X38.63
TS_DIFF9_P: X1.109(TS_DIFF9+) X38.61
TS_DIFF10_N: X1.113(TS_DIFF10-) X38.57
TS_DIFF10_P: X1.115(TS_DIFF10+) X38.55
TS_DIFF11_N: X1.119(TS_DIFF11-) X38.51
TS_DIFF11_P: X1.121(TS_DIFF11+) X38.49
TS_DIFF12_N: X1.125(TS_DIFF12-) X38.43
TS_DIFF12_P: X1.127(TS_DIFF12+) X38.41
TS_DIFF13_N: X1.131(TS_DIFF13-) X38.37
TS_DIFF13_P: X1.133(TS_DIFF13+) X38.35
TS_DIFF14_N: X1.137(TS_DIFF14-) X38.29
TS_DIFF14_P: X1.139(TS_DIFF14+) X38.27
TS_DIFF15_N: X1.143(TS_DIFF15-) X38.23
TS_DIFF15_P: X1.145(TS_DIFF15+) X38.21
TS_DIFF16_N: X1.149(TS_DIFF16-) X38.17
TS_DIFF16_P: X1.151(TS_DIFF16+) X38.15
TS_DIFF17_N: X1.155(TS_DIFF17-) X38.11
TS_DIFF17_P: X1.157(TS_DIFF17+) X38.9
TS_DIFF18_N: X1.161(TS_DIFF18-) X38.5
TS_DIFF18_P: X1.163(TS_DIFF18+) X38.3
UART4_RXD: X38.96
UART4_TXD: X38.94
WAKE1_MICO#: X38.98

Not connected (* = marked no-connect by the designer): X38 54* 70* 80*

### Buses and harness runs
bus CAM1_MXM[0..17] = port CAM1_MXM[0..17]
bus GPIO[1..8] = port GPIO[1..8]
bus I2C1[0..1] = port I2C1[0..1]
bus SPI[0..7] = port SPI[0..7]
bus SYSTEM_CTRL[0..3] = port SYSTEM_CTRL[0..3]
bus TS[0..41]
bus UART[0..16] = port UART[0..16]

### Layout directives
differential pair: TS_DIFF1_N, TS_DIFF1_P, TS_DIFF2_N, TS_DIFF2_P, TS_DIFF3_N, TS_DIFF3_P, TS_DIFF4_N, TS_DIFF4_P, TS_DIFF5_N, TS_DIFF5_P, TS_DIFF6_N, TS_DIFF6_P, TS_DIFF7_N, TS_DIFF7_P, TS_DIFF8_N, TS_DIFF8_P, TS_DIFF9_N, TS_DIFF9_P, TS_DIFF10_N, TS_DIFF10_P, TS_DIFF11_N, TS_DIFF11_P, TS_DIFF12_N, TS_DIFF12_P, TS_DIFF13_N, TS_DIFF13_P, TS_DIFF14_N, TS_DIFF14_P, TS_DIFF15_N, TS_DIFF15_P, TS_DIFF16_N, TS_DIFF16_P, TS_DIFF17_N, TS_DIFF17_P, TS_DIFF18_N, TS_DIFF18_P

### Notes on the sheet
- (near C116) Place Close to the Module Connector
- Title
- Size:
- Date:
- A3
- Number:
- Time:
- Revision:
- Sheet
- of
- File:
- (in symbol CON-JAE-MM70-314-310B1-314-0.5mm, part T) Apalis - Type Specific; 20 of 25

### Library data of the parts
C116 = C-X7R-1nF-50V-10%-0402: Capacitor Ceramic X7R 1nF 50V 10% 0402; Tolerance: 10%; Type: X7R; Value: 1nF
X1 = CON-JAE-MM70-314-310B1-314-0.5mm: as X1 on sheet RGB_Displays
X38 = CON-Samtec-QSH-060-01-L-D-A: High Speed Ground Plane Socket; Manufacturer Name: Samtec; Pitch: 0.5mm; No. of ways: 120; Manufacturer Part No.: QSH-060-01-L-D-A